# EAGLE schematic R42_ECU (EAGLE 9.6.2)
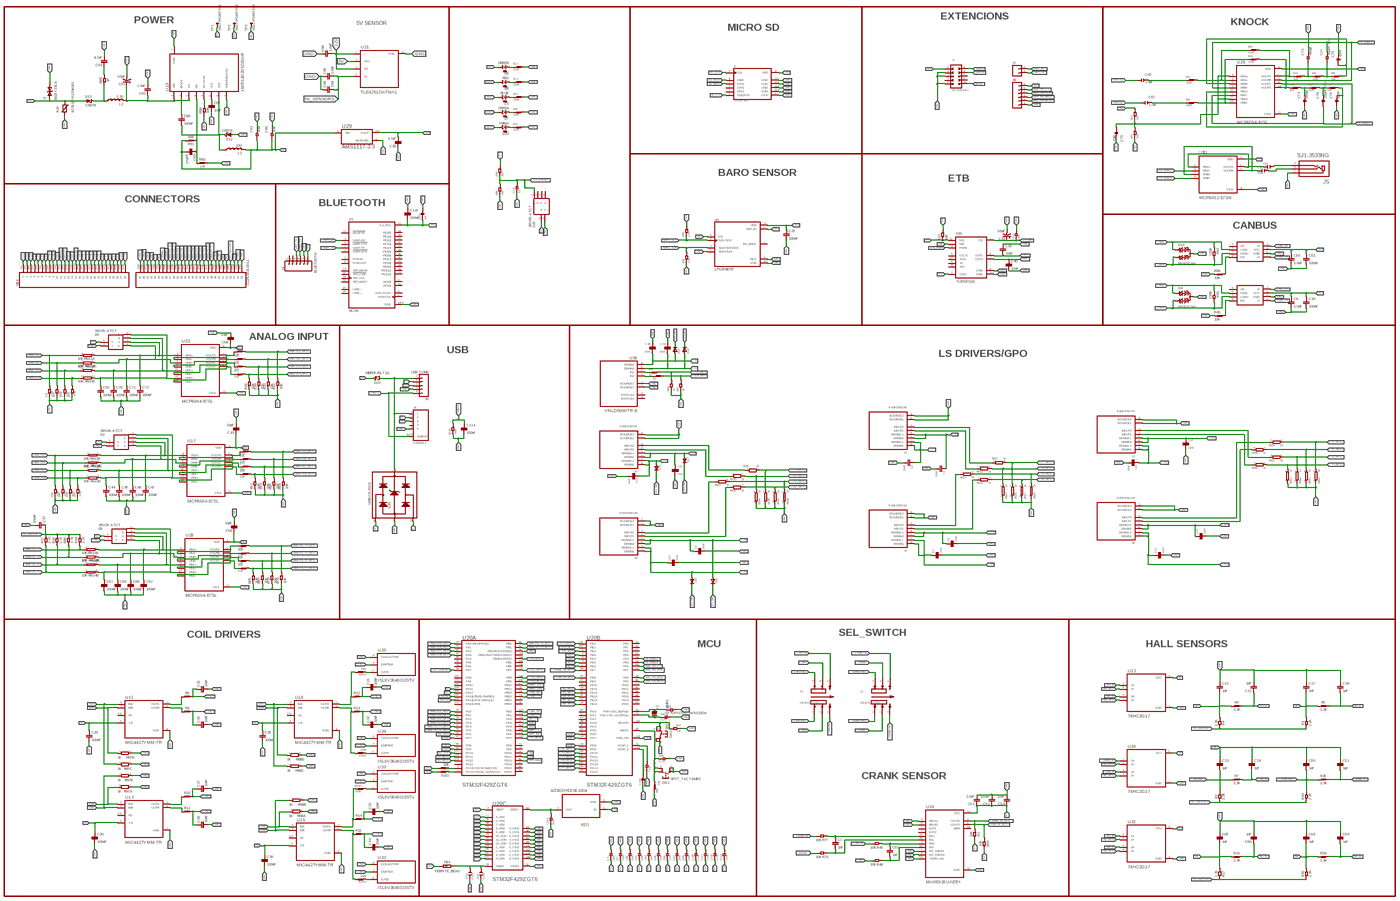
[diagram p0: schematic, sheet 1, overview]
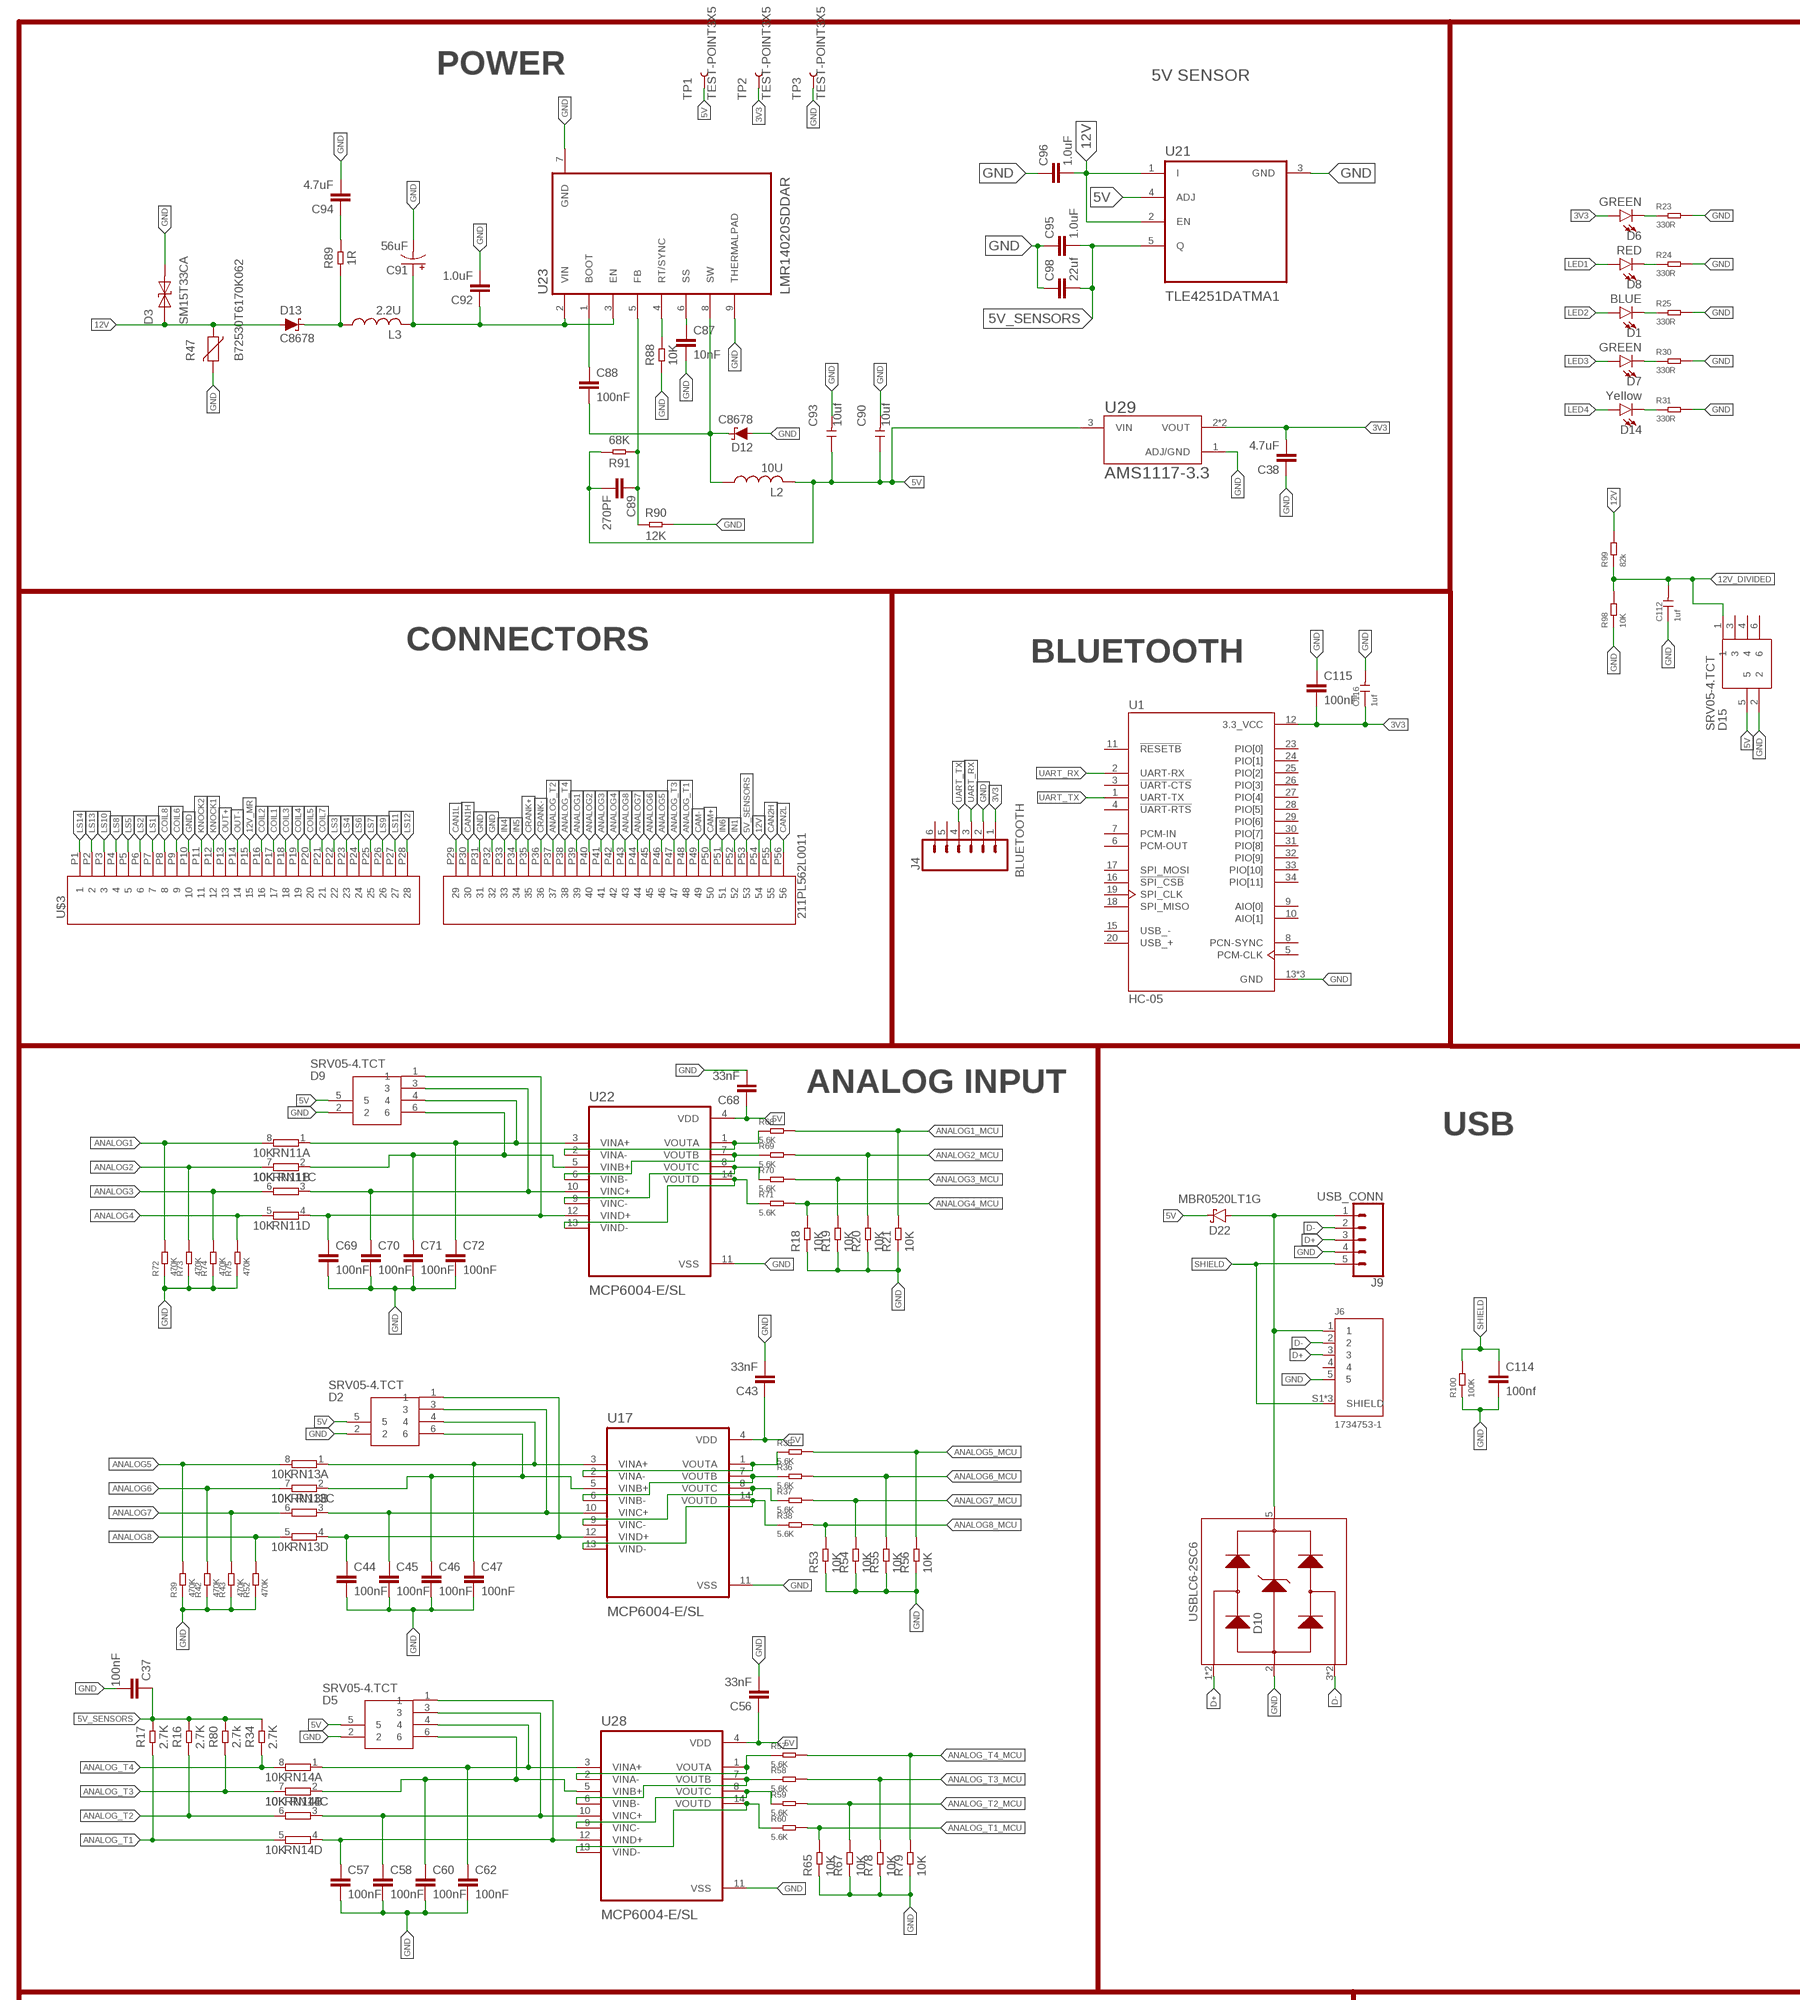
[diagram p1: schematic, sheet 1, part 1 of 6]
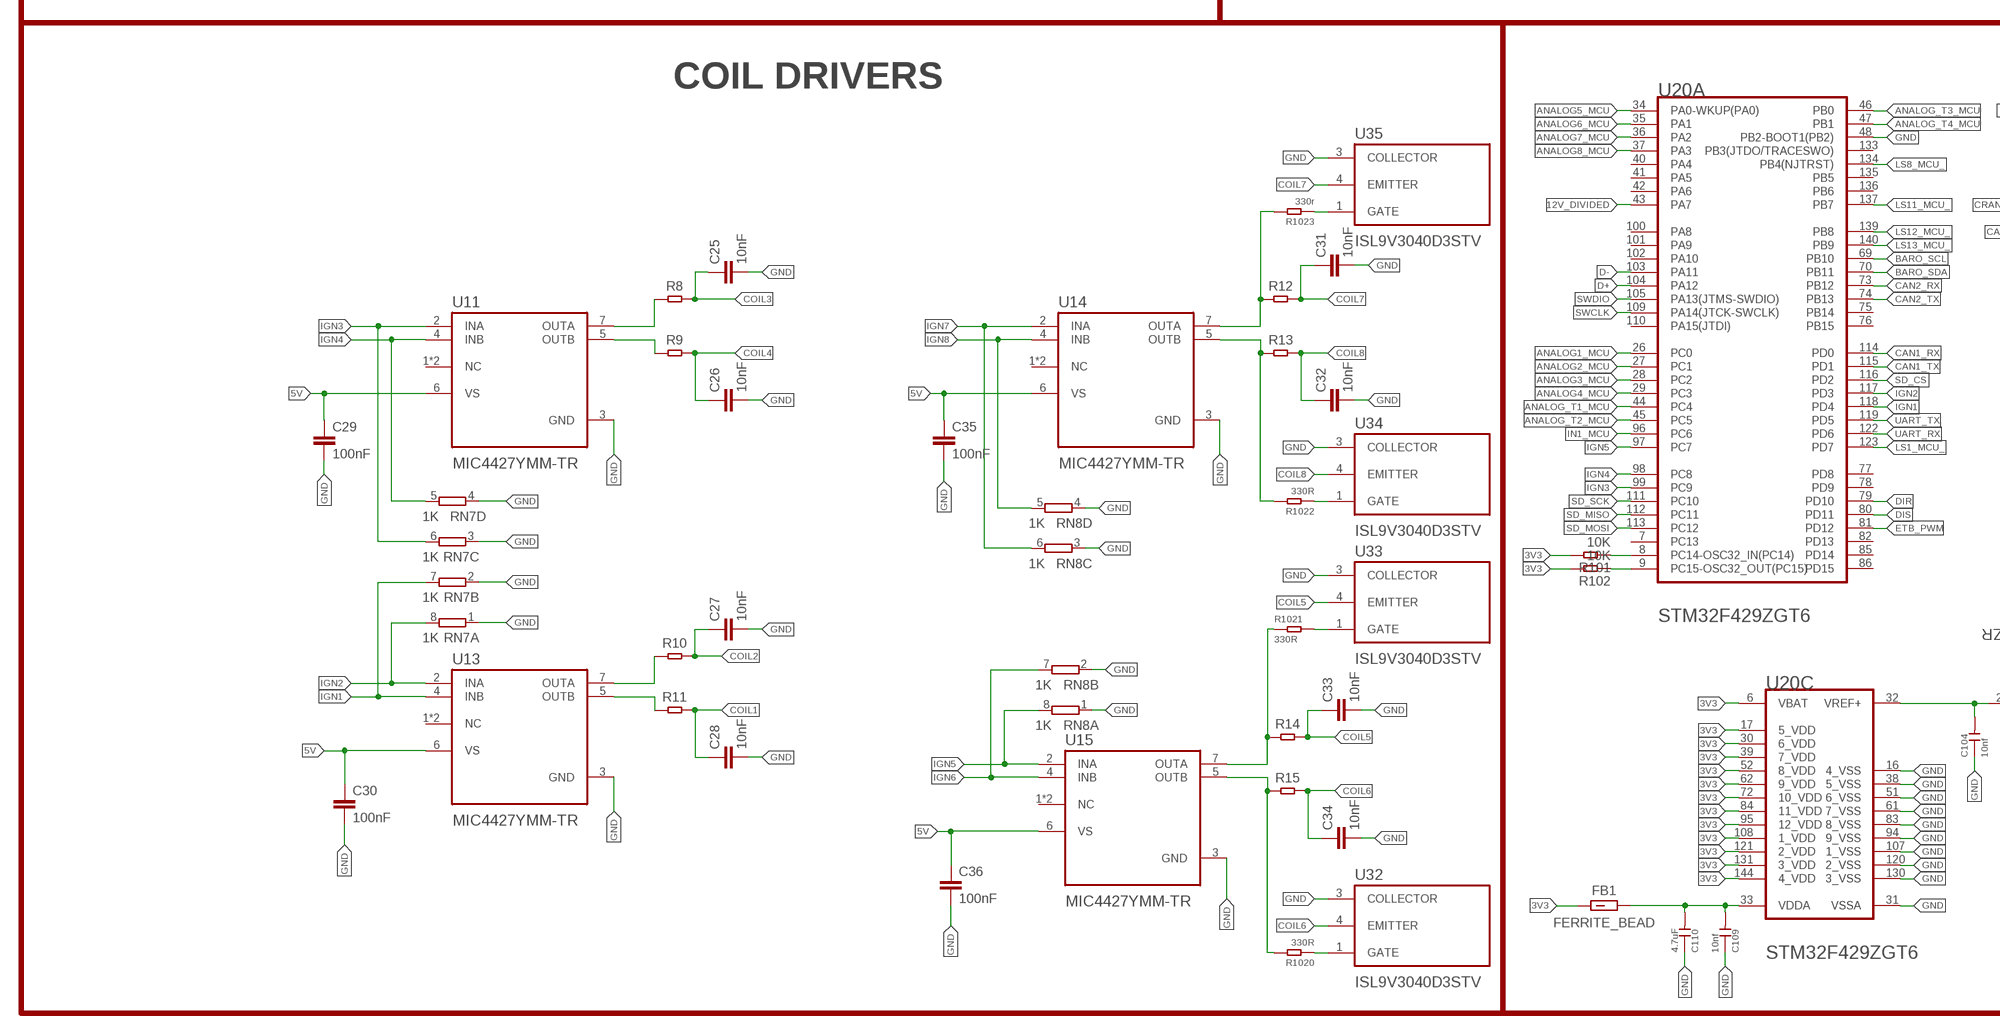
[diagram p2: schematic, sheet 1, part 2 of 6]
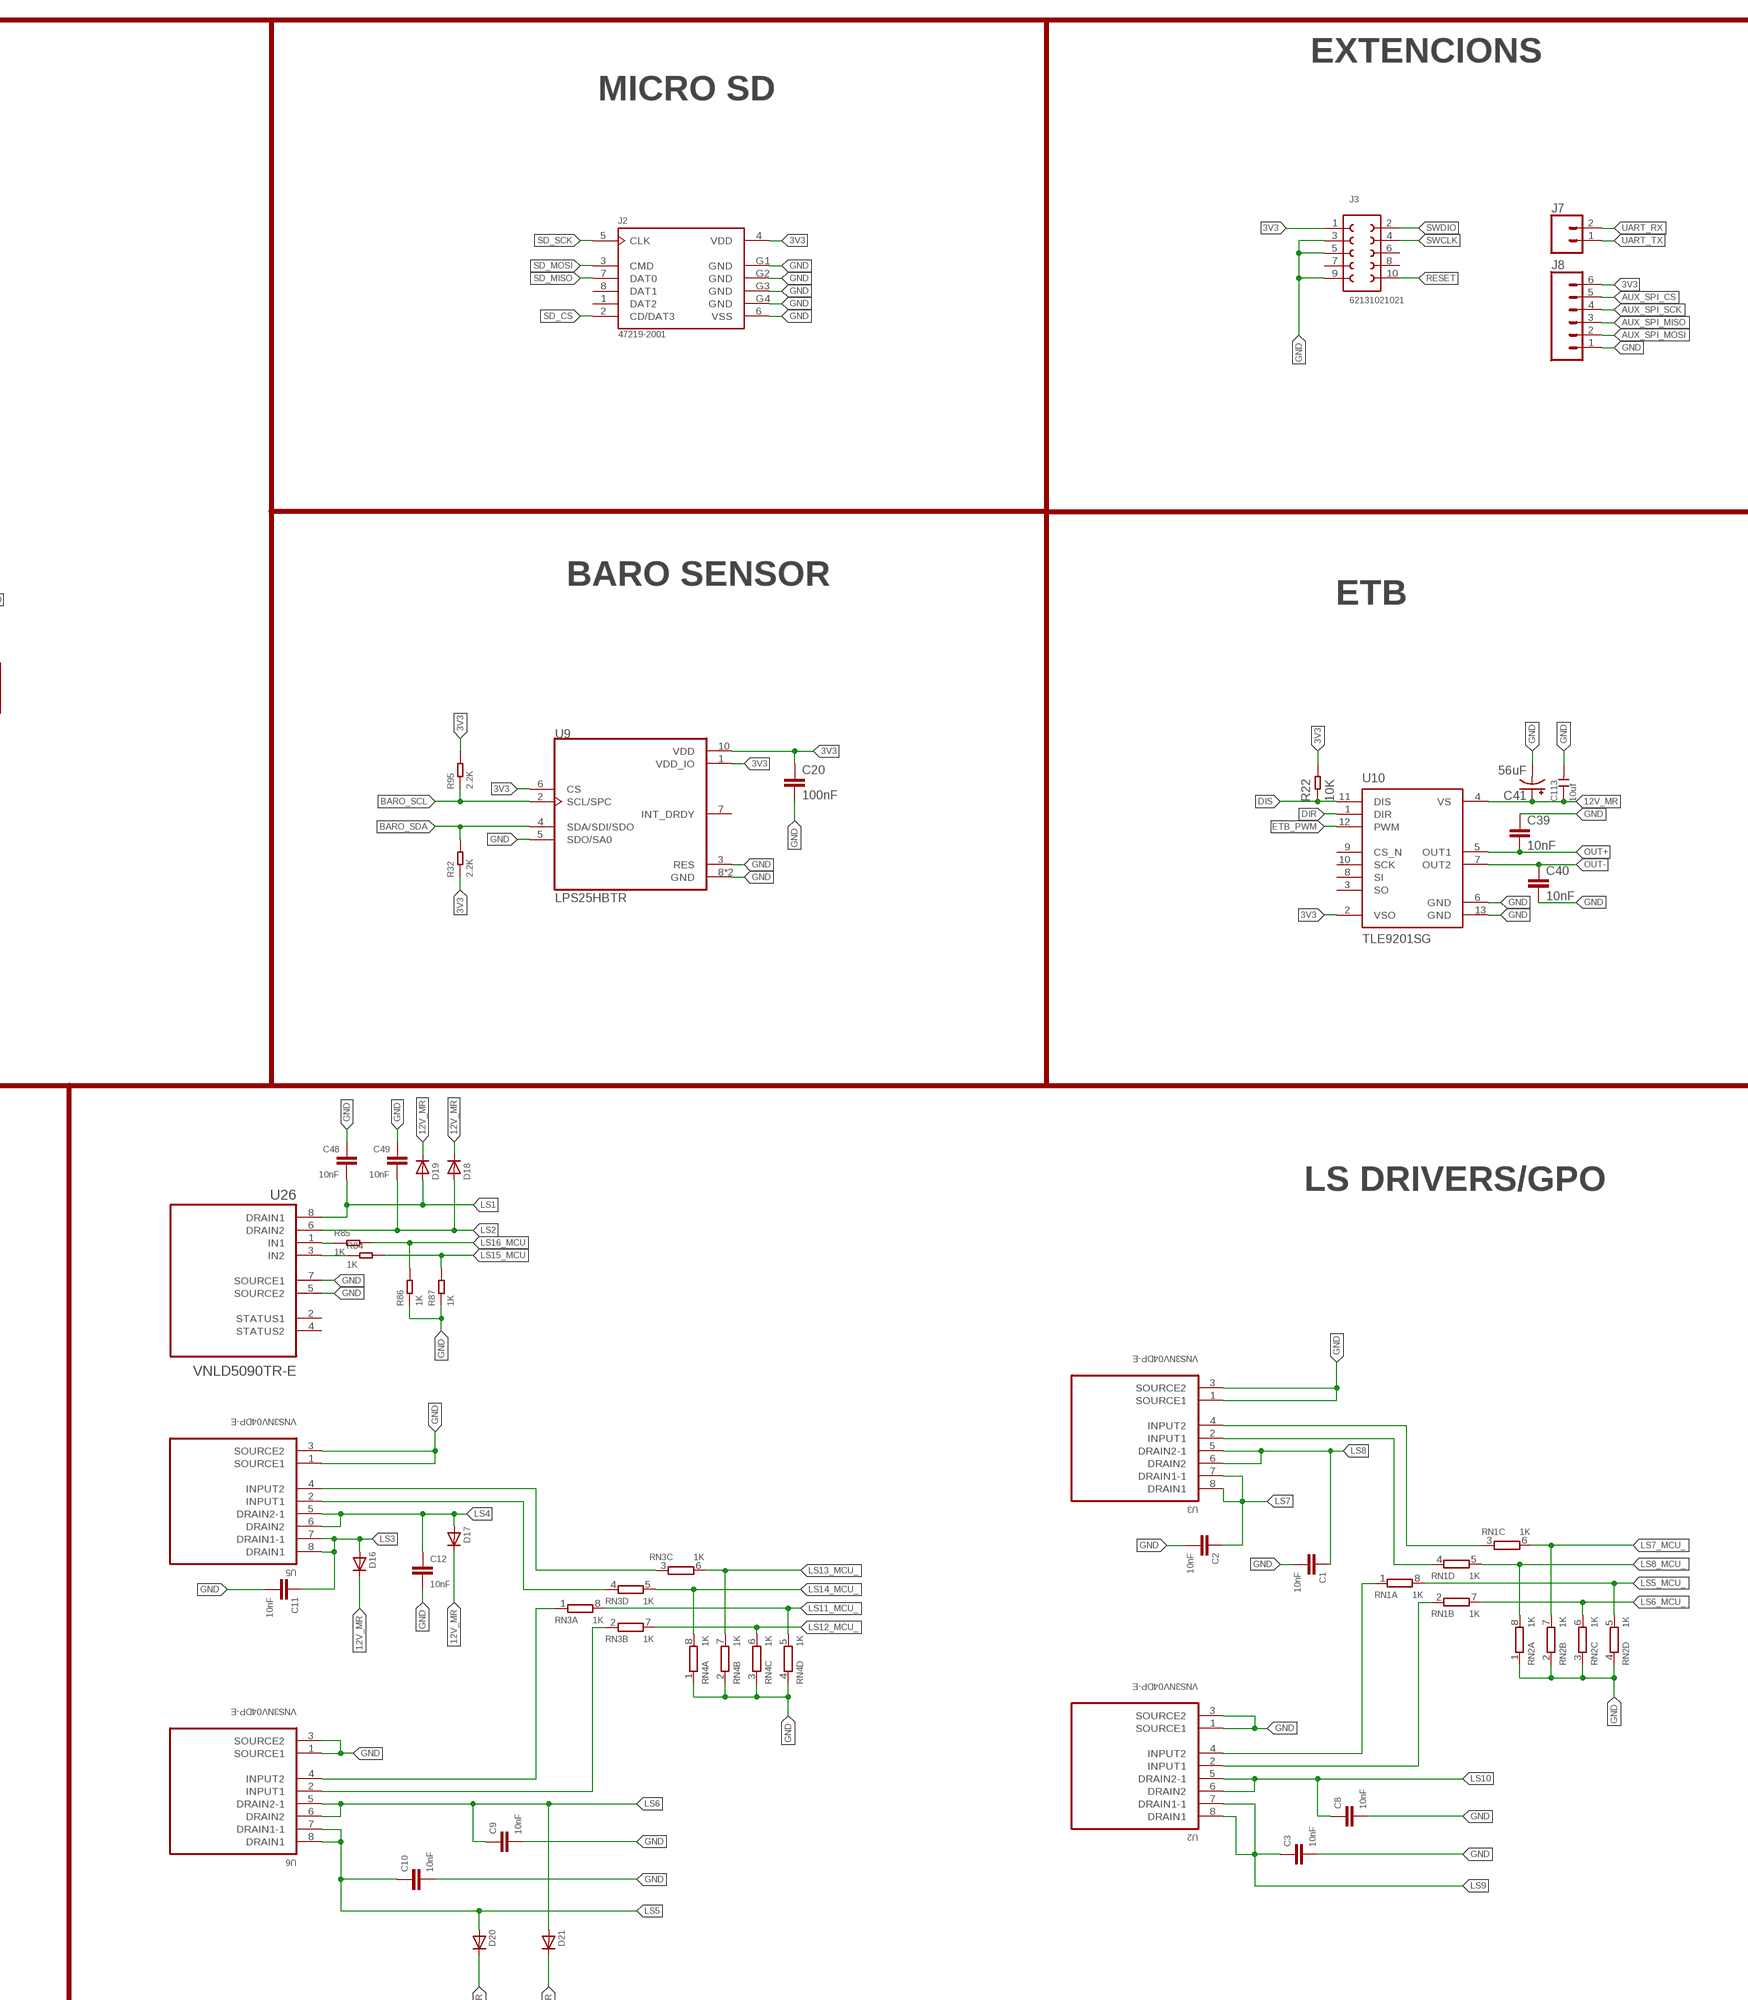
[diagram p3: schematic, sheet 1, part 3 of 6]
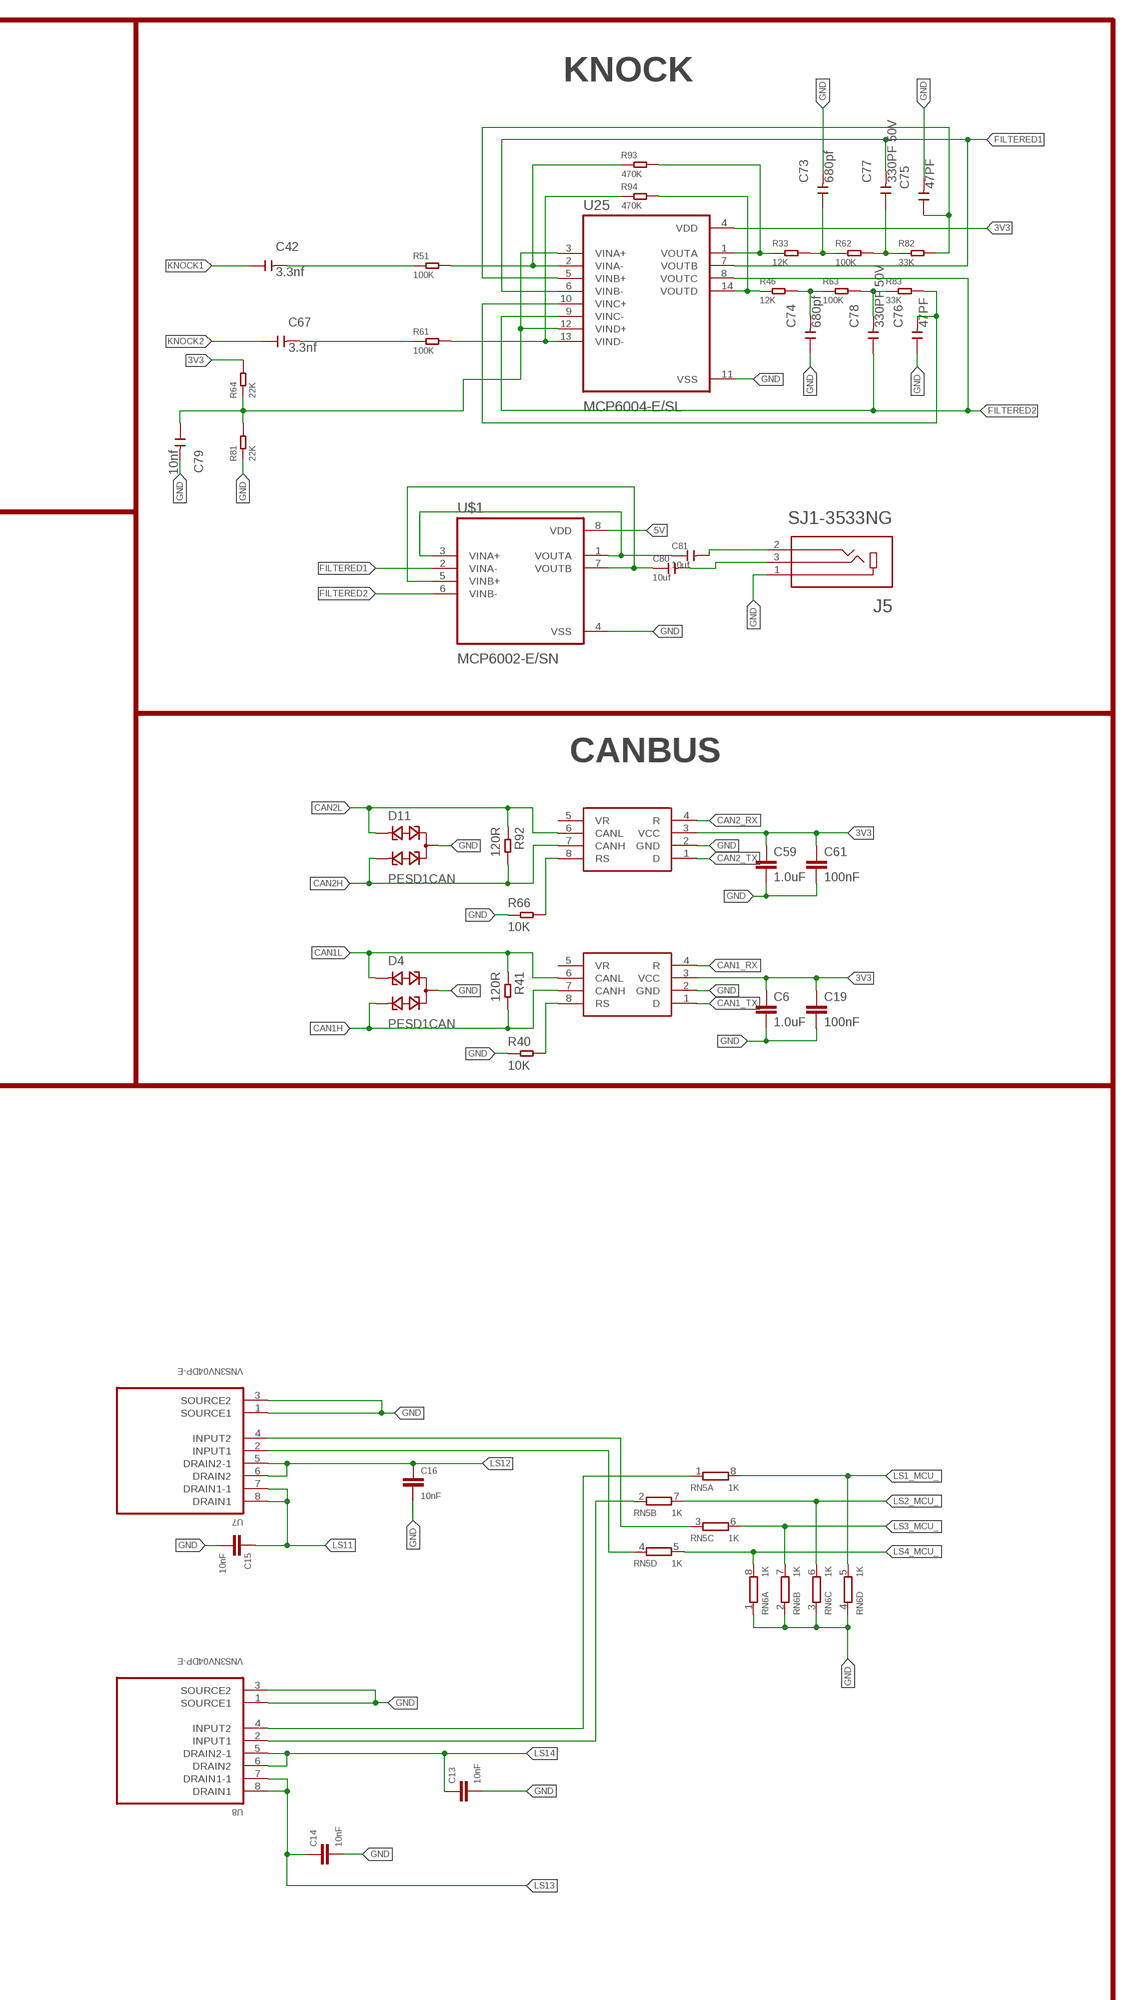
[diagram p4: schematic, sheet 1, part 4 of 6]
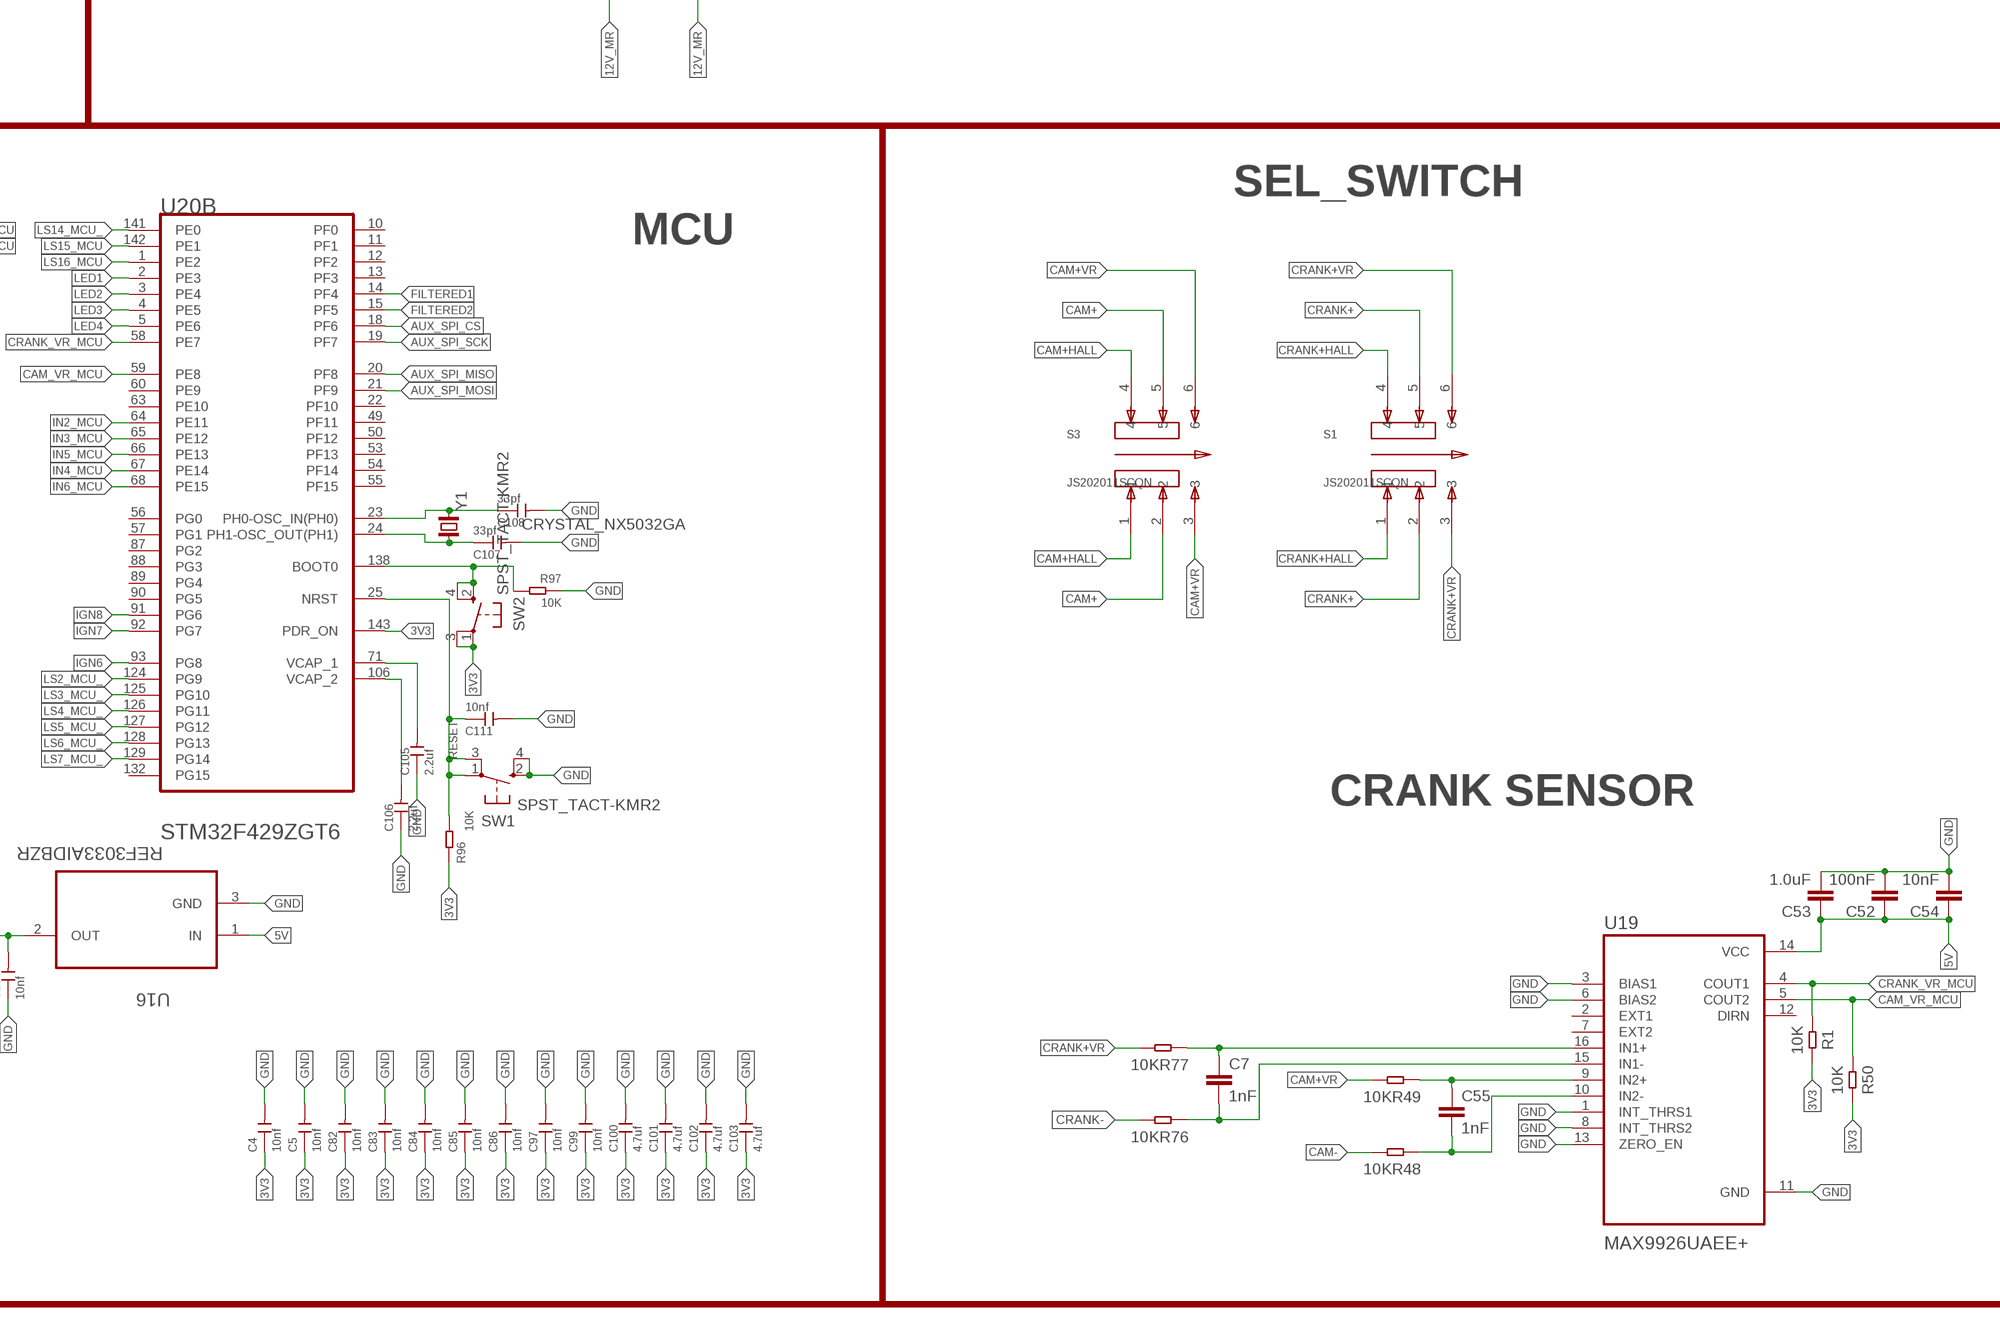
[diagram p5: schematic, sheet 1, part 5 of 6]
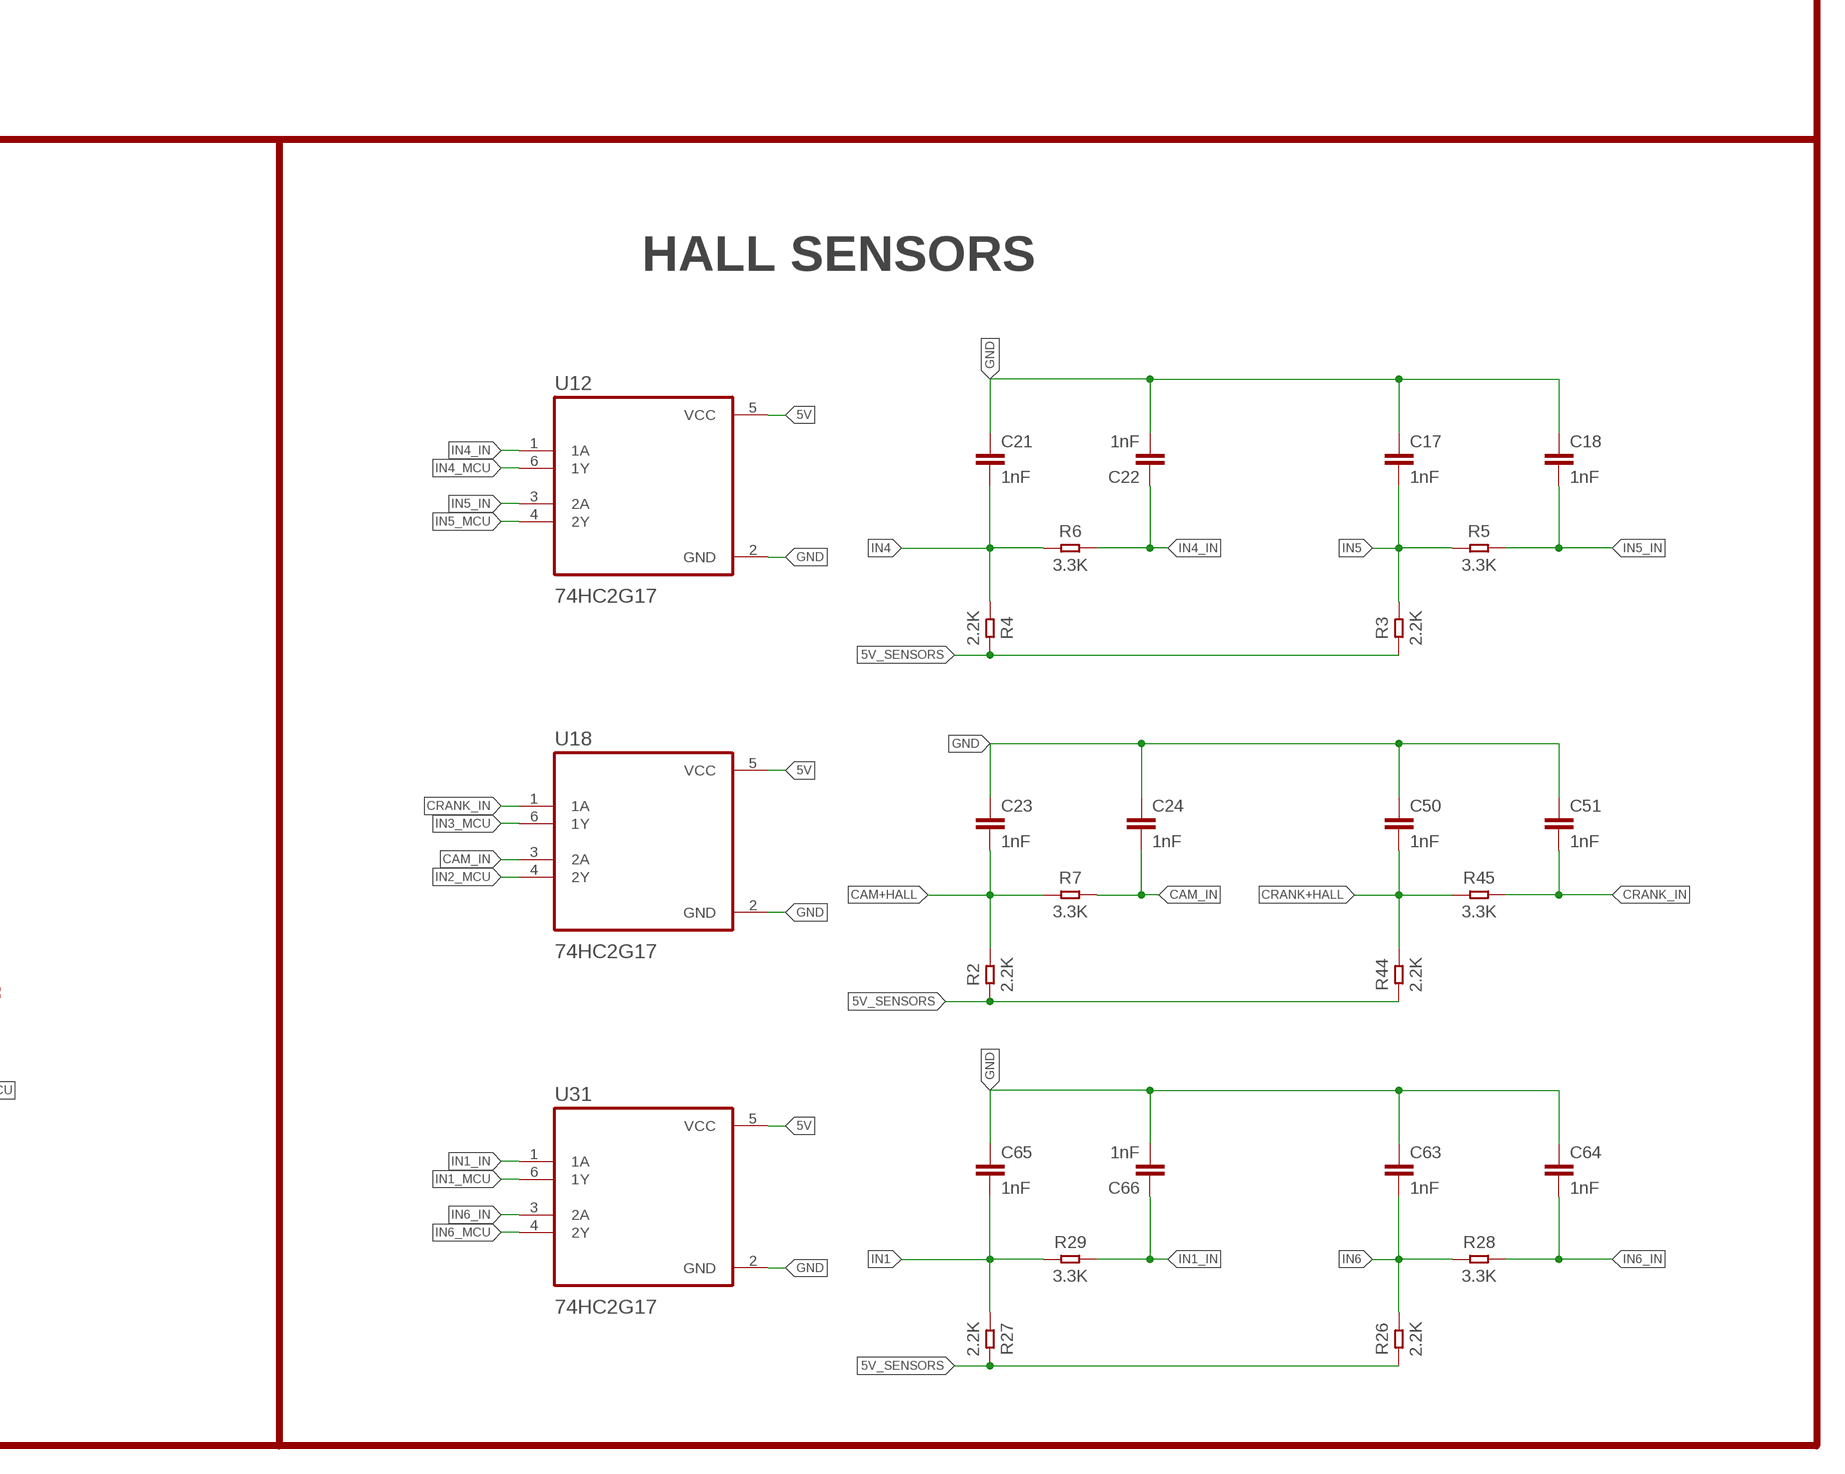
[diagram p6: schematic, sheet 1, part 6 of 6]

## Parts
C1  10nF  10NF-0603-50V-10%  [0603]
C2  10nF  10NF-0603-50V-10%  [0603]
C3  10nF  10NF-0603-50V-10%  [0603]
C4  10nf  CERAMIC-10NF-50V-10%-X7R(0603)  [C0603]
C5  10nf  CERAMIC-10NF-50V-10%-X7R(0603)  [C0603]
C6  1.0uF  1.0UF-0603-16V-10%  [0603]
C7  1nF  1.0NF/1000PF-0603-50V-10%  [0603]
C8  10nF  10NF-0603-50V-10%  [0603]
C9  10nF  10NF-0603-50V-10%  [0603]
C10  10nF  10NF-0603-50V-10%  [0603]
C11  10nF  10NF-0603-50V-10%  [0603]
C12  10nF  10NF-0603-50V-10%  [0603]
C13  10nF  10NF-0603-50V-10%  [0603]
C14  10nF  10NF-0603-50V-10%  [0603]
C15  10nF  10NF-0603-50V-10%  [0603]
C16  10nF  10NF-0603-50V-10%  [0603]
C17  1nF  1.0NF/1000PF-0603-50V-10%  [0603]
C18  1nF  1.0NF/1000PF-0603-50V-10%  [0603]
C19  100nF  0.1UF-0603-25V-(+80/-20%)  [0603]
C20  100nF  1.0UF-0603-16V-10%  [0603]
C21  1nF  1.0NF/1000PF-0603-50V-10%  [0603]
C22  1nF  1.0NF/1000PF-0603-50V-10%  [0603]
C23  1nF  1.0NF/1000PF-0603-50V-10%  [0603]
C24  1nF  1.0NF/1000PF-0603-50V-10%  [0603]
C25  10nF  10NF-0603-50V-10%  [0603]
C26  10nF  10NF-0603-50V-10%  [0603]
C27  10nF  10NF-0603-50V-10%  [0603]
C28  10nF  10NF-0603-50V-10%  [0603]
C29  100nF  0.1UF-0603-25V-(+80/-20%)  [0603]
C30  100nF  0.1UF-0603-25V-(+80/-20%)  [0603]
C31  10nF  10NF-0603-50V-10%  [0603]
C32  10nF  10NF-0603-50V-10%  [0603]
C33  10nF  10NF-0603-50V-10%  [0603]
C34  10nF  10NF-0603-50V-10%  [0603]
C35  100nF  0.1UF-0603-25V-(+80/-20%)  [0603]
C36  100nF  0.1UF-0603-25V-(+80/-20%)  [0603]
C37  100nF  0.1UF-0603-25V-(+80/-20%)  [0603]
C38  4.7uF  4.7UF0603  [0603]
C39  10nF  10NF-0603-50V-10%  [0603]
C40  10nF  10NF-0603-50V-10%  [0603]
C41  56uF  CPOL-USE3.5-8  [E3,5-8]
C42  3.3nf  CERAMIC-10NF-50V-5%-X7R(0805)  [C0805]
C43  33nF  33NF-0603-50V-10%  [0603]
C44  100nF  22PF-0603-50V-5%  [0603]
C45  100nF  22PF-0603-50V-5%  [0603]
C46  100nF  22PF-0603-50V-5%  [0603]
C47  100nF  22PF-0603-50V-5%  [0603]
C48  10nF  10NF-0603-50V-10%  [0603]
C49  10nF  10NF-0603-50V-10%  [0603]
C50  1nF  1.0NF/1000PF-0603-50V-10%  [0603]
C51  1nF  1.0NF/1000PF-0603-50V-10%  [0603]
C52  100nF  0.1UF-0603-25V-(+80/-20%)  [0603]
C53  1.0uF  1.0UF-0603-16V-10%  [0603]
C54  10nF  10NF-0603-50V-10%  [0603]
C55  1nF  1.0NF/1000PF-0603-50V-10%  [0603]
C56  33nF  33NF-0603-50V-10%  [0603]
C57  100nF  22PF-0603-50V-5%  [0603]
C58  100nF  22PF-0603-50V-5%  [0603]
C59  1.0uF  1.0UF-0603-16V-10%  [0603]
C60  100nF  22PF-0603-50V-5%  [0603]
C61  100nF  0.1UF-0603-25V-(+80/-20%)  [0603]
C62  100nF  22PF-0603-50V-5%  [0603]
C63  1nF  1.0NF/1000PF-0603-50V-10%  [0603]
C64  1nF  1.0NF/1000PF-0603-50V-10%  [0603]
C65  1nF  1.0NF/1000PF-0603-50V-10%  [0603]
C66  1nF  1.0NF/1000PF-0603-50V-10%  [0603]
C67  3.3nf  CERAMIC-10NF-50V-5%-X7R(0805)  [C0805]
C68  33nF  33NF-0603-50V-10%  [0603]
C69  100nF  22PF-0603-50V-5%  [0603]
C70  100nF  22PF-0603-50V-5%  [0603]
C71  100nF  22PF-0603-50V-5%  [0603]
C72  100nF  22PF-0603-50V-5%  [0603]
C73  680pf  CERAMIC-100NF-50V-10%-X7R(0603)  [C0603]
C74  680pf  CERAMIC-100NF-50V-10%-X7R(0603)  [C0603]
C75  47PF  CERAMIC-47PF-50V-5%-NP0(0402)  [C0402]
C76  47PF  CERAMIC-47PF-50V-5%-NP0(0402)  [C0402]
C77  330PF 50V  CERAMIC-390PF-50V-10%-X7R(0402)  [C0402]
C78  330PF 50V  CERAMIC-390PF-50V-10%-X7R(0402)  [C0402]
C79  10nf  CERAMIC-10NF-50V-10%-X7R(0402)  [C0402]
C80  10uf  CERAMIC-10UF-10V-(-20%～+80%)-Y5V(0805)  [C0805]
C81  10uf  CERAMIC-10UF-10V-(-20%～+80%)-Y5V(0805)  [C0805]
C82  10nf  CERAMIC-10NF-50V-10%-X7R(0603)  [C0603]
C83  10nf  CERAMIC-10NF-50V-10%-X7R(0603)  [C0603]
C84  10nf  CERAMIC-10NF-50V-10%-X7R(0603)  [C0603]
C85  10nf  CERAMIC-10NF-50V-10%-X7R(0603)  [C0603]
C86  10nf  CERAMIC-10NF-50V-10%-X7R(0603)  [C0603]
C87  10nF  10NF-0603-50V-10%  [0603]
C88  100nF  0.1UF-0603-25V-(+80/-20%)  [0603]
C89  270PF  270PF-0603-50V-5%  [0603]
C90  10uf  CERAMIC-10UF-25V-10%-X5R(1206)  [C1206]
C91  56uF  CPOL-USE3.5-8  [E3,5-8]
C92  1.0uF  1.0UF-0603-16V-10%  [0603]
C93  10uf  CERAMIC-10UF-25V-10%-X5R(1206)  [C1206]
C94  4.7uF  4.7UF0603  [0603]
C95  1.0uF  1.0UF-0603-16V-10%  [0603]
C96  1.0uF  1.0UF-0603-16V-10%  [0603]
C97  10nf  CERAMIC-10NF-50V-10%-X7R(0603)  [C0603]
C98  22uf  22PF-0603-50V-5%  [0603]
C99  10nf  CERAMIC-10NF-50V-10%-X7R(0603)  [C0603]
C100  4.7uf  CERAMIC-4.7UF-10V-10%-X5R(0603)  [C0603]
C101  4.7uf  CERAMIC-4.7UF-10V-10%-X5R(0603)  [C0603]
C102  4.7uf  CERAMIC-4.7UF-10V-10%-X5R(0603)  [C0603]
C103  4.7uf  CERAMIC-4.7UF-10V-10%-X5R(0603)  [C0603]
C104  10nf  CERAMIC-10NF-50V-10%-X7R(0603)  [C0603]
C105  2.2uf  CERAMIC-2.2UF-10V-10%-X7R(0603)  [C0603]
C106  2.2uf  CERAMIC-2.2UF-10V-10%-X7R(0603)  [C0603]
C107  33pf  CERAMIC-33PF-50V-5%-NPO(0402)  [C0402]
C108  33pf  CERAMIC-33PF-50V-5%-NPO(0402)  [C0402]
C109  10nf  CERAMIC-10NF-50V-10%-X7R(0603)  [C0603]
C110  4.7uF  CERAMIC-4.7NF-50V-10%-X7R(0603)  [C0603]
C111  10nf  CERAMIC-10NF-50V-10%-X7R(0603)  [C0603]
C112  1uf  CERAMIC-1UF-25V-10%-X7R(0603)  [C0603]
C113  10uf  CERAMIC-10UF-25V-10%-X5R(1206)  [C1206]
C114  100nf  0.1UF-0603-25V-(+80/-20%)  [0603]
C115  100nF  0.1UF-0603-25V-(+80/-20%)  [0603]
C116  1uf  CERAMIC-1UF-25V-10%-X7R(0603)  [C0603]
D1  BLUE  LED-BLUE0603  [LED-0603]
D2  SRV05-4.TCT  [SOT95P280X145-6N]
D3  SM15T33CA  SMCJ45CA  [DIOM7959X262N]
D4  PESD1CAN  [SOT23]
D5  SRV05-4.TCT  [SOT95P280X145-6N]
D6  GREEN  LED-GREEN0603  [LED-0603]
D7  GREEN  LED-GREEN0603  [LED-0603]
D8  RED  LED-RED0603  [LED-0603]
D9  SRV05-4.TCT  [SOT95P280X145-6N]
D10  USBLC6-2SC6  [SOT95P280X145-6N]
D11  PESD1CAN  [SOT23]
D12  C8678  DIODE-SCHOTTKY-B340A  [SMA-DIODE]
D13  C8678  DIODE-SCHOTTKY-B340A  [SMA-DIODE]
D14  Yellow  LED-YELLOW0603  [LED-0603]
D15  SRV05-4.TCT  [SOT95P280X145-6N]
D16  MBR0520LT1G  DIODE_SOD-123FL  [SOD-123FL]
D17  MBR0520LT1G  DIODE_SOD-123FL  [SOD-123FL]
D18  MBR0520LT1G  DIODE_SOD-123FL  [SOD-123FL]
D19  MBR0520LT1G  DIODE_SOD-123FL  [SOD-123FL]
D20  MBR0520LT1G  DIODE_SOD-123FL  [SOD-123FL]
D21  MBR0520LT1G  DIODE_SOD-123FL  [SOD-123FL]
D22  MBR0520LT1G  SCHOTTKY_MBR0520LT1GDO-219  [SODFL3718X115]
FB1  FERRITE_BEAD  FBCHIP-0805(2012-METRIC)  [BEADC2012X105N]
J2  47219-2001  [MOLEX_47219-2001]
J3  62131021021  [62131021021]
J4  CONN_06NO_SILK_NO_POP  [1X06_NO_SILK]
J5  SJ1-3533NG  [CUI_SJ1-3533NG]
J6  1734753-1  [CONN_1734753-1]
J7  CONN_02  [1X02]
J8  CONN_06SILK_FEMALE_PTH  [1X06]
J9  USB_CONN  CONN_05NO_SILK  [1X05_NO_SILK]
L2  10U  L-US  [0503]
L3  2.2U  L-USL3225M  [L3225M]
R1  10K  SMD-RES-10K-1%-1/8W(0805)  [R0805]
R2  2.2K  SMD-RES-2.2K-5%-1/10W(0603)  [R0603]
R3  2.2K  SMD-RES-2.2K-5%-1/10W(0603)  [R0603]
R4  2.2K  SMD-RES-2.2K-5%-1/10W(0603)  [R0603]
R5  3.3K  SMD-RES-3.3K-1%-1/10W(0603)  [R0603]
R6  3.3K  SMD-RES-3.3K-1%-1/10W(0603)  [R0603]
R7  3.3K  SMD-RES-3.3K-1%-1/10W(0603)  [R0603]
R8  100R  SMD-RES-100R-5%-1/8W(0805)  [R0805]
R9  100R  SMD-RES-100R-5%-1/8W(0805)  [R0805]
R10  100R  SMD-RES-100R-5%-1/8W(0805)  [R0805]
R11  100R  SMD-RES-100R-5%-1/8W(0805)  [R0805]
R12  100R  SMD-RES-100R-5%-1/8W(0805)  [R0805]
R13  100R  SMD-RES-100R-5%-1/8W(0805)  [R0805]
R14  100R  SMD-RES-100R-5%-1/8W(0805)  [R0805]
R15  100R  SMD-RES-100R-5%-1/8W(0805)  [R0805]
R16  2.7K  SMD-RES-2K-1%-1/10W(0603)  [R0603]
R17  2.7K  SMD-RES-2K-1%-1/10W(0603)  [R0603]
R18  10K  SMD-RES-10K-1%-1/10W(0603)  [R0603]
R19  10K  SMD-RES-10K-1%-1/10W(0603)  [R0603]
R20  10K  SMD-RES-10K-1%-1/10W(0603)  [R0603]
R21  10K  SMD-RES-10K-1%-1/10W(0603)  [R0603]
R22  10K  SMD-RES-10K-1%-1/10W(0603)  [R0603]
R23  330R  SMD-RES-330R-1%-1/16W(0402)  [R0402]
R24  330R  SMD-RES-330R-1%-1/16W(0402)  [R0402]
R25  330R  SMD-RES-330R-1%-1/16W(0402)  [R0402]
R26  2.2K  SMD-RES-2.2K-5%-1/10W(0603)  [R0603]
R27  2.2K  SMD-RES-2.2K-5%-1/10W(0603)  [R0603]
R28  3.3K  SMD-RES-3.3K-1%-1/10W(0603)  [R0603]
R29  3.3K  SMD-RES-3.3K-1%-1/10W(0603)  [R0603]
R30  330R  SMD-RES-330R-1%-1/16W(0402)  [R0402]
R31  330R  SMD-RES-330R-1%-1/16W(0402)  [R0402]
R32  2.2K  SMD-RES-2.2K-1%-1/10W(0603)  [R0603]
R33  12K  SMD-RES-12K-1%-1/16W(0402)  [R0402]
R34  2.7K  SMD-RES-2K-1%-1/10W(0603)  [R0603]
R35  5.6K  SMD-RES-330R-1%-1/10W(0603)  [R0603]
R36  5.6K  SMD-RES-330R-1%-1/10W(0603)  [R0603]
R37  5.6K  SMD-RES-330R-1%-1/10W(0603)  [R0603]
R38  5.6K  SMD-RES-330R-1%-1/10W(0603)  [R0603]
R39  470K  SMD-RES-470K-1%-1/10W(0603)  [R0603]
R40  10K  SMD-RES-10K-1%-1/10W(0603)  [R0603]
R41  120R  SMD-RES-100R-5%-1/10W(0603)  [R0603]
R42  470K  SMD-RES-470K-1%-1/10W(0603)  [R0603]
R43  470K  SMD-RES-470K-1%-1/10W(0603)  [R0603]
R44  2.2K  SMD-RES-2.2K-5%-1/10W(0603)  [R0603]
R45  3.3K  SMD-RES-3.3K-1%-1/10W(0603)  [R0603]
R46  12K  SMD-RES-12K-1%-1/16W(0402)  [R0402]
R47  B72530T6170K062  VARISTOR-5  [R-5]
R48  10K  SMD-RES-10K-1%-1/8W(0805)  [R0805]
R49  10K  SMD-RES-10K-1%-1/8W(0805)  [R0805]
R50  10K  SMD-RES-10K-1%-1/8W(0805)  [R0805]
R51  100K  SMD-RES-100K-1%-1/16W(0402)  [R0402]
R52  470K  SMD-RES-470K-1%-1/10W(0603)  [R0603]
R53  10K  SMD-RES-10K-1%-1/10W(0603)  [R0603]
R54  10K  SMD-RES-10K-1%-1/10W(0603)  [R0603]
R55  10K  SMD-RES-10K-1%-1/10W(0603)  [R0603]
R56  10K  SMD-RES-10K-1%-1/10W(0603)  [R0603]
R57  5.6K  SMD-RES-330R-1%-1/10W(0603)  [R0603]
R58  5.6K  SMD-RES-330R-1%-1/10W(0603)  [R0603]
R59  5.6K  SMD-RES-330R-1%-1/10W(0603)  [R0603]
R60  5.6K  SMD-RES-330R-1%-1/10W(0603)  [R0603]
R61  100K  SMD-RES-100K-1%-1/16W(0402)  [R0402]
R62  100K  SMD-RES-100K-1%-1/16W(0402)  [R0402]
R63  100K  SMD-RES-100K-1%-1/16W(0402)  [R0402]
R64  22K  SMD-RES-22R-1%-1/16W(0402)  [R0402]
R65  10K  SMD-RES-10K-1%-1/10W(0603)  [R0603]
R66  10K  SMD-RES-10K-1%-1/10W(0603)  [R0603]
R67  10K  SMD-RES-10K-1%-1/10W(0603)  [R0603]
R68  5.6K  SMD-RES-330R-1%-1/10W(0603)  [R0603]
R69  5.6K  SMD-RES-330R-1%-1/10W(0603)  [R0603]
R70  5.6K  SMD-RES-330R-1%-1/10W(0603)  [R0603]
R71  5.6K  SMD-RES-330R-1%-1/10W(0603)  [R0603]
R72  470K  SMD-RES-470K-1%-1/10W(0603)  [R0603]
R73  470K  SMD-RES-470K-1%-1/10W(0603)  [R0603]
R74  470K  SMD-RES-470K-1%-1/10W(0603)  [R0603]
R75  470K  SMD-RES-470K-1%-1/10W(0603)  [R0603]
R76  10K  SMD-RES-10K-1%-1/8W(0805)  [R0805]
R77  10K  SMD-RES-10K-1%-1/8W(0805)  [R0805]
R78  10K  SMD-RES-10K-1%-1/10W(0603)  [R0603]
R79  10K  SMD-RES-10K-1%-1/10W(0603)  [R0603]
R80  2.7k  SMD-RES-2K-1%-1/10W(0603)  [R0603]
R81  22K  SMD-RES-22R-1%-1/16W(0402)  [R0402]
R82  33K  SMD-RES-30K-1%-1/16W(0402)  [R0402]
R83  33K  SMD-RES-30K-1%-1/16W(0402)  [R0402]
R84  1K  SMD-RES-1K-1%-1/16W(0402)  [R0402]
R85  1K  SMD-RES-1K-1%-1/16W(0402)  [R0402]
R86  1K  SMD-RES-1K-1%-1/16W(0402)  [R0402]
R87  1K  SMD-RES-1K-1%-1/16W(0402)  [R0402]
R88  10K  SMD-RES-10K-1%-1/10W(0603)  [R0603]
R89  1R  SMD-RES-0R-5%-1/10W(0603)  [R0603]
R90  12K  SMD-RES-12K-1%-1/16W(0402)  [R0402]
R91  68K  SMD-RES-68K-1%-1/10W(0603)  [R0603]
R92  120R  SMD-RES-100R-5%-1/10W(0603)  [R0603]
R93  470K  SMD-RES-470K-1%-1/16W(0402)  [R0402]
R94  470K  SMD-RES-470K-1%-1/16W(0402)  [R0402]
R95  2.2K  SMD-RES-2.2K-1%-1/10W(0603)  [R0603]
R96  10K  SMD-RES-10K-1%-1/10W(0603)  [R0603]
R97  10K  SMD-RES-10K-1%-1/10W(0603)  [R0603]
R98  10K  SMD-RES-10K-1%-1/10W(0603)  [R0603]
R99  82k  SMD-RES-120K-1%-1/10W(0603)  [R0603]
R100  100K  SMD-RES-100K-1%-1/16W(0402)  [R0402]
R101  10K  SMD-RES-10K-1%-1/10W(0603)  [R0603]
R102  10K  SMD-RES-10K-1%-1/10W(0603)  [R0603]
R1020  330R  SMD-RES-330R-1%-1/8W(0805)  [R0805]
R1021  330R  SMD-RES-330R-1%-1/8W(0805)  [R0805]
R1022  330R  SMD-RES-330R-1%-1/8W(0805)  [R0805]
R1023  330r  SMD-RES-330R-1%-1/8W(0805)  [R0805]
RN1  1K  4R-N0603-ARC  [0603-ARC]
RN2  1K  4R-N0603-ARC  [0603-ARC]
RN3  1K  4R-N0603-ARC  [0603-ARC]
RN4  1K  4R-N0603-ARC  [0603-ARC]
RN5  1K  4R-N0603-ARC  [0603-ARC]
RN6  1K  4R-N0603-ARC  [0603-ARC]
RN7  1K  4R-N0603-ARC  [0603-ARC]
RN8  1K  4R-N0603-ARC  [0603-ARC]
RN11  10K  4R-N0603-ARC  [0603-ARC]
RN13  10K  4R-N0603-ARC  [0603-ARC]
RN14  10K  4R-N0603-ARC  [0603-ARC]
S1  JS202011SCQN  [SW_JS202011SCQN]
S3  JS202011SCQN  [SW_JS202011SCQN]
SW1  SPST_TACT-KMR2  [KMR2]
SW2  SPST_TACT-KMR2  [KMR2]
TP1  TEST-POINT3X5  [PAD.03X.05]
TP2  TEST-POINT3X5  [PAD.03X.05]
TP3  TEST-POINT3X5  [PAD.03X.05]
U1  HC-05  [XCVR_HC-05]
U2  VNS3NV04DP-E  [SOIC127P600X175-8N]
U3  VNS3NV04DP-E  [SOIC127P600X175-8N]
U5  VNS3NV04DP-E  [SOIC127P600X175-8N]
U6  VNS3NV04DP-E  [SOIC127P600X175-8N]
U7  VNS3NV04DP-E  [SOIC127P600X175-8N]
U8  VNS3NV04DP-E  [SOIC127P600X175-8N]
U9  LPS25HBTR  [PQFN60P250X250X80-10N]
U10  TLE9201SG  [SOP100P1030X260-13N]
U11  MIC4427YMM-TR  [SOP65P490X110-8N]
U12  74HC2G17  74HC2G17GW,125  [SOP65P210X110-6N]
U13  MIC4427YMM-TR  [SOP65P490X110-8N]
U14  MIC4427YMM-TR  [SOP65P490X110-8N]
U15  MIC4427YMM-TR  [SOP65P490X110-8N]
U16  REF3033AIDBZR  [SOT95P237X112-3N]
U17  MCP6004-E/SL  [SOIC127P600X175-14N]
U18  74HC2G17  74HC2G17GW,125  [SOP65P210X110-6N]
U19  MAX9926UAEE+  [SOP63P602X175-16N]
U20  STMICROELECTRONICS_STM32F429ZGT6STMICROELECTRONICS_STM32F429ZGT6_0_2  [STMICROELECTRONICS_STM32F429ZGT6_2]
U21  TLE4251DATMA1  [TO114P998X235-5]
U22  MCP6004-E/SL  [SOIC127P600X175-14N]
U23  LMR14020SDDAR  [VREG_LM5017MR/NOPB]
U24  VD230  SN65HVD230  [SO08]
U25  MCP6004-E/SL  [SOIC127P600X175-14N]
U26  VNLD5090TR-E  [SOIC127P600X175-8N]
U27  VD230  SN65HVD230  [SO08]
U28  MCP6004-E/SL  [SOIC127P600X175-14N]
U29  AMS1117-3.3  [SOT229P700X180-4N]
U31  74HC2G17  74HC2G17GW,125  [SOP65P210X110-6N]
U32  ISL9V3040D3STV  [TO229P990X238-4N]
U33  ISL9V3040D3STV  [TO229P990X238-4N]
U34  ISL9V3040D3STV  [TO229P990X238-4N]
U35  ISL9V3040D3STV  [TO229P990X238-4N]
U$1  MCP6002-E/SN  [SOIC127P599X175-8N]
U$3  211PL562L0011  [211PL562L0011]
Y1  CRYSTAL_NX5032GA  [CRYSTAL_2-SMD-5X3]

## Nets
3V3: C4.1 C5.1 C6.1 C19.1 C20.1 C38.2 C59.1 C61.1 C82.1 C83.1 C84.1 C85.1 C86.1 C97.1 C99.1 C100.1 C101.1 C102.1 C103.1 C115.2 C116.1 D6.A FB1.2 J2.4(VDD) J3.1 J4.1 J8.6 R1.2 R22.2 R32.1 R50.2 R64.2 R95.2 R96.1 R101.2 R102.2 SW2.1(P) SW2.3(P1) TP2.P$1 U1.12(3.3_VCC) U9.1(VDD_IO) U9.6(CS) U9.10(VDD) U10.2(VSO) U20.6(C:VBAT) U20.17(C:5_VDD) U20.30(C:6_VDD) U20.39(C:7_VDD) U20.52(C:8_VDD) U20.62(C:9_VDD) U20.72(C:10_VDD) U20.84(C:11_VDD) U20.95(C:12_VDD) U20.108(C:1_VDD) U20.121(C:2_VDD) U20.131(C:3_VDD) U20.143(B:PDR_ON) U20.144(C:4_VDD) U24.3(VCC) U25.4(VDD) U27.3(VCC) U29.2(VOUT) U29.4(VOUT)
5V: C29.1 C30.1 C35.1 C36.1 C43.1 C52.2 C53.1 C54.2 C56.1 C68.1 C89.2 C90.1 C93.1 D2.5 D5.5 D9.5 D15.5 D22.1(C) L2.P$2 R91.2 TP1.P$1 U11.6(VS) U12.5(VCC) U13.6(VS) U14.6(VS) U15.6(VS) U16.1(IN) U17.4(VDD) U18.5(VCC) U19.14(VCC) U21.4(ADJ) U22.4(VDD) U28.4(VDD) U29.3(VIN) U31.5(VCC) U$1.8(VDD)
5V_SENSORS: C37.1 C95.2 C98.2 R2.1 R3.1 R4.2 R16.2 R17.2 R26.1 R27.2 R34.2 R44.1 R80.2 U21.5(Q) U$3.P53
12V: C96.2 D3.1 D13.A R47.1 R99.2 U21.1(I) U21.2(EN) U$3.P54
12V_DIVIDED: C112.2 D15.1 R98.2 R99.1 U20.43(A:PA7)
12V_MR: C41.+ C113.1 D16.C D17.C D18.C D19.C D20.C D21.C U10.4(VS) U$3.P15
ANALOG1: R72.2 RN11.8 U$3.P39
ANALOG1_MCU: R21.2 R68.2 U20.26(A:PC0)
ANALOG2: R73.2 RN11.7 U$3.P40
ANALOG2_MCU: R20.2 R69.2 U20.27(A:PC1)
ANALOG3: R74.2 RN11.6 U$3.P41
ANALOG3_MCU: R19.2 R70.2 U20.28(A:PC2)
ANALOG4: R75.2 RN11.5 U$3.P42
ANALOG4_MCU: R18.2 R71.2 U20.29(A:PC3)
ANALOG5: R39.2 RN13.8 U$3.P46
ANALOG5_MCU: R35.2 R56.2 U20.34(A:PA0-WKUP(PA0))
ANALOG6: R42.2 RN13.7 U$3.P45
ANALOG6_MCU: R36.2 R55.2 U20.35(A:PA1)
ANALOG7: R43.2 RN13.6 U$3.P44
ANALOG7_MCU: R37.2 R54.2 U20.36(A:PA2)
ANALOG8: R52.2 RN13.5 U$3.P43
ANALOG8_MCU: R38.2 R53.2 U20.37(A:PA3)
ANALOG_T1: R17.1 RN14.5 U$3.P48
ANALOG_T1_MCU: R60.2 R65.2 U20.44(A:PC4)
ANALOG_T2: R16.1 RN14.6 U$3.P37
ANALOG_T2_MCU: R59.2 R67.2 U20.45(A:PC5)
ANALOG_T3: R80.1 RN14.7 U$3.P47
ANALOG_T3_MCU: R58.2 R78.2 U20.46(A:PB0)
ANALOG_T4: R34.1 RN14.8 U$3.P38
ANALOG_T4_MCU: R57.2 R79.2 U20.47(A:PB1)
AUX_SPI_CS: J8.5 U20.18(B:PF6)
AUX_SPI_MISO: J8.3 U20.20(B:PF8)
AUX_SPI_MOSI: J8.2 U20.21(B:PF9)
AUX_SPI_SCK: J8.4 U20.19(B:PF7)
BARO_SCL: R95.1 U9.2(SCL/SPC) U20.69(A:PB10)
BARO_SDA: R32.2 U9.4(SDA/SDI/SDO) U20.70(A:PB11)
CAM+: S3.2 S3.5 U$3.P50
CAM+HALL: C23.2 R2.2 R7.1 S3.1 S3.4
CAM+VR: R49.2 S3.3 S3.6
CAM-: R48.2 U$3.P49
CAM_IN: C24.2 R7.2 U18.3(2A)
CAM_VR_MCU: R50.1 U19.5(COUT2) U20.59(B:PE8)
CAN1_RX: U20.114(A:PD0) U27.4(R)
CAN1_TX: U20.115(A:PD1) U27.1(D)
CAN1H: D4.2 R41.2 U27.7(CANH) U$3.P30
CAN1L: D4.1 R41.1 U27.6(CANL) U$3.P29
CAN2_RX: U20.73(A:PB12) U24.4(R)
CAN2_TX: U20.74(A:PB13) U24.1(D)
CAN2H: D11.2 R92.2 U24.7(CANH) U$3.P55
CAN2L: D11.1 R92.1 U24.6(CANL) U$3.P56
COIL1: C28.1 R11.2 U$3.P17
COIL2: C27.1 R10.2 U$3.P16
COIL3: C25.1 R8.2 U$3.P18
COIL4: C26.1 R9.2 U$3.P19
COIL5: C33.1 R14.2 U33.4(EMITTER) U$3.P20
COIL6: C34.1 R15.2 U32.4(EMITTER) U$3.P9
COIL7: C31.1 R12.2 U35.4(EMITTER) U$3.P21
COIL8: C32.1 R13.2 U34.4(EMITTER) U$3.P8
CRANK+: S1.2 S1.5 U$3.P35
CRANK+HALL: C50.2 R44.2 R45.1 S1.1 S1.4
CRANK+VR: R77.2 S1.3 S1.6
CRANK-: R76.2 U$3.P36
CRANK_IN: C51.2 R45.2 U18.1(1A)
CRANK_VR_MCU: R1.1 U19.4(COUT1) U20.58(B:PE7)
D+: D10.1(I/O1) D10.6(I/O1) J6.3 J9.3 U20.104(A:PA12)
D-: D10.3(I/O2) D10.4(I/O2) J6.2 J9.2 U20.103(A:PA11)
DIR: U10.1(DIR) U20.79(A:PD10)
DIS: R22.1 U10.11(DIS) U20.80(A:PD11)
ETB_PWM: U10.12(PWM) U20.81(A:PD12)
FILTERED1: C77.2 U20.14(B:PF4) U25.6(VINB-) U25.7(VOUTB) U$1.2(VINA-)
FILTERED2: C78.1 U20.15(B:PF5) U25.8(VOUTC) U25.9(VINC-) U$1.6(VINB-)
GND: C1.2 C2.2 C3.2 C4.2 C5.2 C6.2 C8.2 C9.2 C10.2 C11.2 C12.2 C13.2 C14.2 C15.2 C16.2 C17.1 C18.1 C19.2 C20.2 C21.1 C22.2 C23.1 C24.1 C25.2 C26.2 C27.2 C28.2 C29.2 C30.2 C31.2 C32.2 C33.2 C34.2 C35.2 C36.2 C37.2 C38.1 C39.1 C40.2 C41.- C43.2 C44.2 C45.2 C46.2 C47.2 C48.1 C49.1 C50.1 C51.1 C52.1 C53.2 C54.1 C56.2 C57.2 C58.2 C59.2 C60.2 C61.2 C62.2 C63.1 C64.1 C65.1 C66.2 C68.2 C69.2 C70.2 C71.2 C72.2 C73.2 C74.1 C75.2 C76.1 C79.2 C82.2 C83.2 C84.2 C85.2 C86.2 C87.2 C90.2 C91.- C92.2 C93.2 C94.2 C95.1 C96.1 C97.2 C98.1 C99.2 C100.2 C101.2 C102.2 C103.2 C104.1 C105.1 C106.1 C107.2 C108.2 C109.1 C110.1 C111.2 C112.1 C113.2 C114.2 C115.1 C116.2 D2.2 D3.2 D4.3 D5.2 D9.2 D10.2(GND) D11.3 D12.A D15.2 J2.6(VSS) J2.G1(GND) J2.G2(GND) J2.G3(GND) J2.G4(GND) J3.3 J3.5 J3.9 J4.2 J5.1 J6.5 J8.1 J9.4 R18.1 R19.1 R20.1 R21.1 R23.2 R24.2 R25.2 R30.2 R31.2 R39.1 R40.1 R42.1 R43.1 R47.2 R52.1 R53.1 R54.1 R55.1 R56.1 R65.1 R66.1 R67.1 R72.1 R73.1 R74.1 R75.1 R78.1 R79.1 R81.1 R86.1 R87.1 R88.1 R90.2 R97.1 R98.1 R100.1 RN2.1 RN2.2 RN2.3 RN2.4 RN4.1 RN4.2 RN4.3 RN4.4 RN6.1 RN6.2 RN6.3 RN6.4 RN7.1 RN7.2 RN7.3 RN7.4 RN8.1 RN8.2 RN8.3 RN8.4 SW1.2(S) SW1.4(S1) TP3.P$1 U1.13(GND) U1.21(GND) U1.22(GND) U2.1(SOURCE1) U2.3(SOURCE2) U3.1(SOURCE1) U3.3(SOURCE2) U5.1(SOURCE1) U5.3(SOURCE2) U6.1(SOURCE1) U6.3(SOURCE2) U7.1(SOURCE1) U7.3(SOURCE2) U8.1(SOURCE1) U8.3(SOURCE2) U9.3(RES) U9.5(SDO/SA0) U9.8(GND) U9.9(GND) U10.6(GND) U10.13(GND) U11.3(GND) U12.2(GND) U13.3(GND) U14.3(GND) U15.3(GND) U16.3(GND) U17.11(VSS) U18.2(GND) U19.1(INT_THRS1) U19.3(BIAS1) U19.6(BIAS2) U19.8(INT_THRS2) U19.11(GND) U19.13(ZERO_EN) U20.16(C:4_VSS) U20.31(C:VSSA) U20.38(C:5_VSS) U20.48(A:PB2-BOOT1(PB2)) U20.51(C:6_VSS) U20.61(C:7_VSS) U20.83(C:8_VSS) U20.94(C:9_VSS) U20.107(C:1_VSS) U20.120(C:2_VSS) U20.130(C:3_VSS) U21.3(GND) U22.11(VSS) U23.7(GND) U23.9(THERMALPAD) U24.2(GND) U25.11(VSS) U26.5(SOURCE2) U26.7(SOURCE1) U27.2(GND) U28.11(VSS) U29.1(ADJ/GND) U31.2(GND) U32.3(COLLECTOR) U33.3(COLLECTOR) U34.3(COLLECTOR) U35.3(COLLECTOR) U$1.4(VSS) U$3.P10 U$3.P31 U$3.P32
IGN1: RN7.7 U13.4(INB) U20.118(A:PD4)
IGN2: RN7.8 U13.2(INA) U20.117(A:PD3)
IGN3: RN7.6 U11.2(INA) U20.99(A:PC9)
IGN4: RN7.5 U11.4(INB) U20.98(A:PC8)
IGN5: RN8.8 U15.2(INA) U20.97(A:PC7)
IGN6: RN8.7 U15.4(INB) U20.93(B:PG8)
IGN7: RN8.6 U14.2(INA) U20.92(B:PG7)
IGN8: RN8.5 U14.4(INB) U20.91(B:PG6)
IN1: C65.2 R27.1 R29.1 U$3.P52
IN1_IN: C66.1 R29.2 U31.1(1A)
IN1_MCU: U20.96(A:PC6) U31.6(1Y)
IN2_MCU: U18.4(2Y) U20.64(B:PE11)
IN3_MCU: U18.6(1Y) U20.65(B:PE12)
IN4: C21.2 R4.1 R6.1 U$3.P33
IN4_IN: C22.1 R6.2 U12.1(1A)
IN4_MCU: U12.6(1Y) U20.67(B:PE14)
IN5: C17.2 R3.2 R5.1 U$3.P34
IN5_IN: C18.2 R5.2 U12.3(2A)
IN5_MCU: U12.4(2Y) U20.66(B:PE13)
IN6: C63.2 R26.2 R28.1 U$3.P51
IN6_IN: C64.2 R28.2 U31.3(2A)
IN6_MCU: U20.68(B:PE15) U31.4(2Y)
KNOCK1: C42.1 U$3.P12
KNOCK2: C67.1 U$3.P11
LED1: D8.A U20.2(B:PE3)
LED2: D1.A U20.3(B:PE4)
LED3: D7.A U20.4(B:PE5)
LED4: D14.A U20.5(B:PE6)
LS1: C48.2 D19.A U26.8(DRAIN1) U$3.P7
LS1_MCU_: RN5.8 RN6.5 U20.123(A:PD7)
LS2: C49.2 D18.A U26.6(DRAIN2) U$3.P6
LS2_MCU_: RN5.7 RN6.6 U20.124(B:PG9)
LS3: C11.1 D16.A U5.7(DRAIN1-1) U5.8(DRAIN1) U$3.P22
LS3_MCU_: RN5.6 RN6.7 U20.125(B:PG10)
LS4: C12.1 D17.A U5.5(DRAIN2-1) U5.6(DRAIN2) U$3.P23
LS4_MCU_: RN5.5 RN6.8 U20.126(B:PG11)
LS5: C10.1 D20.A U6.7(DRAIN1-1) U6.8(DRAIN1) U$3.P5
LS5_MCU_: RN1.8 RN2.5 U20.127(B:PG12)
LS6: C9.1 D21.A U6.5(DRAIN2-1) U6.6(DRAIN2) U$3.P24
LS6_MCU_: RN1.7 RN2.6 U20.128(B:PG13)
LS7: C2.1 U3.7(DRAIN1-1) U3.8(DRAIN1) U$3.P25
LS7_MCU_: RN1.6 RN2.7 U20.129(B:PG14)
LS8: C1.1 U3.5(DRAIN2-1) U3.6(DRAIN2) U$3.P4
LS8_MCU_: RN1.5 RN2.8 U20.134(A:PB4(NJTRST))
LS9: C3.1 U2.7(DRAIN1-1) U2.8(DRAIN1) U$3.P26
LS10: C8.1 U2.5(DRAIN2-1) U2.6(DRAIN2) U$3.P3
LS11: C15.1 U7.7(DRAIN1-1) U7.8(DRAIN1) U$3.P27
LS11_MCU_: RN3.8 RN4.5 U20.137(A:PB7)
LS12: C16.1 U7.5(DRAIN2-1) U7.6(DRAIN2) U$3.P28
LS12_MCU_: RN3.7 RN4.6 U20.139(A:PB8)
LS13: C14.1 U8.7(DRAIN1-1) U8.8(DRAIN1) U$3.P2
LS13_MCU_: RN3.6 RN4.7 U20.140(A:PB9)
LS14: C13.1 U8.5(DRAIN2-1) U8.6(DRAIN2) U$3.P1
LS14_MCU_: RN3.5 RN4.8 U20.141(B:PE0)
LS15_MCU: R84.2 R87.2 U20.142(B:PE1)
LS16_MCU: R85.2 R86.2 U20.1(B:PE2)
N$1: C88.2 D12.C L2.P$1 U23.8(SW)
N$2: RN1.3 U3.4(INPUT2)
N$3: RN3.3 U5.4(INPUT2)
N$4: R85.1 U26.1(IN1)
N$5: R68.1 U22.1(VOUTA) U22.2(VINA-)
N$6: R84.1 U26.3(IN2)
N$7: RN5.2 U8.2(INPUT1)
N$8: RN1.4 U3.2(INPUT1)
N$9: RN5.1 U8.4(INPUT2)
N$10: R8.1 U11.7(OUTA)
N$11: C55.1 R49.1 U19.9(IN2+)
N$12: C91.+ C92.1 L3.2 U23.2(VIN) U23.3(EN)
N$13: C81.1 U$1.1(VOUTA) U$1.3(VINA+)
N$14: C55.2 R48.1 U19.10(IN2-)
N$15: D6.C R23.1
N$16: C80.1 U$1.5(VINB+) U$1.7(VOUTB)
N$17: R40.2 U27.8(RS)
N$18: C71.1 D9.6 RN11.2 U22.5(VINB+)
N$19: C72.1 D9.4 RN11.1 U22.3(VINA+)
N$20: D8.C R24.1
N$21: C67.2 R61.1
N$22: R69.1 U22.6(VINB-) U22.7(VOUTB)
N$23: R70.1 U22.8(VOUTC) U22.9(VINC-)
N$24: R71.1 U22.13(VIND-) U22.14(VOUTD)
N$25: C42.2 R51.1
N$26: R51.2 R93.1 U25.2(VINA-)
N$27: R61.2 R94.1 U25.13(VIND-)
N$28: C70.1 D9.3 RN11.3 U22.10(VINC+)
N$29: C69.1 D9.1 RN11.4 U22.12(VIND+)
N$30: R46.1 R94.2 U25.14(VOUTD)
N$31: R33.1 R93.2 U25.1(VOUTA)
N$32: C73.1 R33.2 R62.1
N$33: C45.1 D2.3 RN13.3 U17.10(VINC+)
N$34: C44.1 D2.1 RN13.4 U17.12(VIND+)
N$35: R35.1 U17.1(VOUTA) U17.2(VINA-)
N$36: R9.1 U11.5(OUTB)
N$37: R36.1 U17.6(VINB-) U17.7(VOUTB)
N$38: R37.1 U17.8(VOUTC) U17.9(VINC-)
N$39: R38.1 U17.13(VIND-) U17.14(VOUTD)
N$40: C46.1 D2.6 RN13.2 U17.5(VINB+)
N$41: C47.1 D2.4 RN13.1 U17.3(VINA+)
N$42: C58.1 D5.3 RN14.3 U28.10(VINC+)
N$43: C57.1 D5.1 RN14.4 U28.12(VIND+)
N$45: R57.1 U28.1(VOUTA) U28.2(VINA-)
N$46: R58.1 U28.6(VINB-) U28.7(VOUTB)
N$47: R59.1 U28.8(VOUTC) U28.9(VINC-)
N$48: C60.1 D5.6 RN14.2 U28.5(VINB+)
N$49: C62.1 D5.4 RN14.1 U28.3(VINA+)
N$50: C74.2 R46.2 R63.1
N$51: C81.2 J5.2
N$52: C80.2 J5.3
N$53: C77.1 R62.2 R82.1
N$54: C78.2 R63.2 R83.1
N$55: D1.C R25.1
N$56: C75.1 R82.2 U25.5(VINB+)
N$57: D7.C R30.1
N$58: D14.C R31.1
N$59: C76.2 R83.2 U25.10(VINC+)
N$60: C104.2 U16.2(OUT) U20.32(C:VREF+)
N$61: R1023.1 U35.1(GATE)
N$62: R1022.1 U34.1(GATE)
N$63: R1021.2 U33.1(GATE)
N$64: C105.2 U20.71(B:VCAP_1)
N$65: C79.1 R64.1 R81.2 U25.3(VINA+) U25.12(VIND+)
N$66: C106.2 U20.106(B:VCAP_2)
N$67: C109.2 C110.2 FB1.1 U20.33(C:VDDA)
N$68: R1020.1 U32.1(GATE)
N$69: C107.1 U20.24(B:PH1-OSC_OUT(PH1)) Y1.1
N$70: C108.1 U20.23(B:PH0-OSC_IN(PH0)) Y1.2
N$71: R60.1 U28.13(VIND-) U28.14(VOUTD)
N$73: R97.2 SW2.2(S) SW2.4(S1) U20.138(B:BOOT0)
N$74: R101.1 U20.8(A:PC14-OSC32_IN(PC14))
N$75: R102.1 U20.9(A:PC15-OSC32_OUT(PC15))
N$92: RN1.1 U2.4(INPUT2)
N$93: RN1.2 U2.2(INPUT1)
N$94: R10.1 U13.7(OUTA)
N$95: R11.1 U13.5(OUTB)
N$101: R12.1 R1023.2 U14.7(OUTA)
N$103: R13.1 R1022.2 U14.5(OUTB)
N$104: R14.1 R1021.1 U15.7(OUTA)
N$105: R15.1 R1020.2 U15.5(OUTB)
N$110: RN3.2 U6.2(INPUT1)
N$111: RN3.1 U6.4(INPUT2)
N$119: RN3.4 U5.2(INPUT1)
N$145: C89.1 R90.1 R91.1 U23.5(FB)
N$148: D10.5(VBUS) D22.2(A) J6.1 J9.1
N$170: R66.2 U24.8(RS)
N$172: R88.2 U23.4(RT/SYNC)
N$180: C7.1 R77.1 U19.16(IN1+)
N$184: C87.1 U23.6(SS)
N$187: C88.1 U23.1(BOOT)
N$188: D13.C L3.1 R89.1
N$189: C7.2 R76.1 U19.15(IN1-)
N$202: C94.1 R89.2
N$213: RN5.3 U7.4(INPUT2)
N$214: RN5.4 U7.2(INPUT1)
OUT+: C39.2 U10.5(OUT1) U$3.P13
OUT-: C40.1 U10.7(OUT2) U$3.P14
RESET: C111.1 J3.10 R96.2 SW1.1(P) SW1.3(P1) U20.25(B:NRST)
SD_CS: J2.2(CD/DAT3) U20.116(A:PD2)
SD_MISO: J2.7(DAT0) U20.112(A:PC11)
SD_MOSI: J2.3(CMD) U20.113(A:PC12)
SD_SCK: J2.5(CLK) U20.111(A:PC10)
SHIELD: C114.1 J6.S1(SHIELD) J6.S2(SHIELD) J6.S3(SHIELD) J9.5 R100.2
SWCLK: J3.4 U20.109(A:PA14(JTCK-SWCLK))
SWDIO: J3.2 U20.105(A:PA13(JTMS-SWDIO))
UART_RX: J4.3 J7.2 U1.2(UART-RX) U20.122(A:PD6)
UART_TX: J4.4 J7.1 U1.1(UART-TX) U20.119(A:PD5)
Unconnected: D15.3 D15.4 D15.6 J2.1(DAT2) J2.8(DAT1) J3.6 J3.7 J3.8 J4.5 J4.6 J6.4 U1.3(!UART-CTS) U1.4(!UART-RTS) U1.5(PCM-CLK) U1.6(PCM-OUT) U1.7(PCM-IN) U1.8(PCN-SYNC) U1.9(AIO[0]) U1.10(AIO[1]) U1.11(!RESETB) U1.15(USB_-) U1.16(!SPI_CSB) U1.17(SPI_MOSI) U1.18(SPI_MISO) U1.19(SPI_CLK) U1.20(USB_+) U1.23(PIO[0]) U1.24(PIO[1]) U1.25(PIO[2]) U1.26(PIO[3]) U1.27(PIO[4]) U1.28(PIO[5]) U1.29(PIO[6]) U1.30(PIO[7]) U1.31(PIO[8]) U1.32(PIO[9]) U1.33(PIO[10]) U1.34(PIO[11]) U9.7(INT_DRDY) U10.3(SO) U10.8(SI) U10.9(CS_N) U10.10(SCK) U11.1(NC) U11.8(NC) U13.1(NC) U13.8(NC) U14.1(NC) U14.8(NC) U15.1(NC) U15.8(NC) U19.2(EXT1) U19.7(EXT2) U19.12(DIRN) U20.7(A:PC13) U20.10(B:PF0) U20.11(B:PF1) U20.12(B:PF2) U20.13(B:PF3) U20.22(B:PF10) U20.40(A:PA4) U20.41(A:PA5) U20.42(A:PA6) U20.49(B:PF11) U20.50(B:PF12) U20.53(B:PF13) U20.54(B:PF14) U20.55(B:PF15) U20.56(B:PG0) U20.57(B:PG1) U20.60(B:PE9) U20.63(B:PE10) U20.75(A:PB14) U20.76(A:PB15) U20.77(A:PD8) U20.78(A:PD9) U20.82(A:PD13) U20.85(A:PD14) U20.86(A:PD15) U20.87(B:PG2) U20.88(B:PG3) U20.89(B:PG4) U20.90(B:PG5) U20.100(A:PA8) U20.101(A:PA9) U20.102(A:PA10) U20.110(A:PA15(JTDI)) U20.132(B:PG15) U20.133(A:PB3(JTDO/TRACESWO)) U20.135(A:PB5) U20.136(A:PB6) U24.5(VR) U26.2(STATUS1) U26.4(STATUS2) U27.5(VR)

## Notes on the sheet
- EXTENCIONS
- POWER
- 5V SENSOR | KNOCK
- MICRO SD
- BARO SENSOR
- ETB
- CONNECTORS
- BLUETOOTH
- CANBUS
- BLUETOOTH
- ANALOG INPUT
- USB
- LS DRIVERS/GPO
- COIL DRIVERS | SEL_SWITCH
- MCU | HALL SENSORS
- CRANK SENSOR

## Library data of the parts
C1-C3 C8-C16 C25-C28 C31-C34 C39 C40 C48 C49 C54 C87 = SparkFun-Capacitors:10NF: 0.01uF/10nF/10,000pF ceramic capacitors A capacitor is a passive two-terminal electrical component used to store electrical energy temporarily in an electric field. CAP-09321; PROD_ID: CAP-00867
C4 C5 C82-C86 C97 C99 C104 C109 C111 = OPL_Capacitor:CERAMIC-10NF-50V-10%-X7R(0603): 302010140; MPN: CC0603KRX7R9BB103
C6 C53 C59 C92 C95 C96 = SparkFun-Capacitors:1.0UF: 1µF ceramic capacitors A capacitor is a passive two-terminal electrical component used to store electrical energy temporarily in an electric field.; PROD_ID: CAP-00868
C7 C17 C18 C21-C24 C50 C51 C55 C63-C66 = SparkFun-Capacitors:1.0NF/1000PF: 1nF/1,000pF ceramic capacitors A capacitor is a passive two-terminal electrical component used to store electrical energy temporarily in an electric field.; PROD_ID: CAP-07886
C19 C29 C30 C35-C37 C52 C61 C88 C114 C115 = SparkFun-Capacitors:0.1UF: 0.1µF ceramic capacitors A capacitor is a passive two-terminal electrical component used to store electrical energy temporarily in an electric field.; PROD_ID: CAP-00810; VALUE: 0.1uF
C20 = SparkFun-Capacitors:1.0UF: 1µF ceramic capacitors A capacitor is a passive two-terminal electrical component used to store electrical energy temporarily in an electric field.; PROD_ID: CAP-00868; VALUE: 1.0uF
C38 C94 = SparkFun-Capacitors:4.7UF: 4.7µF ceramic capacitors A capacitor is a passive two-terminal electrical component used to store electrical energy temporarily in an electric field.; PROD_ID: CAP-08280
C41 C91 = adafruit:CPOL-US: POLARIZED CAPACITOR, American symbol
C42 C67 = OPL_Capacitor:CERAMIC-10NF-50V-5%-X7R(0805): 302010175; MPN: CC0805JRX7R9BB103; VALUE: 10nf
C43 C56 C68 = SparkFun-Capacitors:33NF: 33nF ceramic capacitors A capacitor is a passive two-terminal electrical component used to store electrical energy temporarily in an electric field.; PROD_ID: CAP-07887
C44-C47 C57 C58 C60 C62 C69-C72 C98 = SparkFun-Capacitors:22PF: 22pF ceramic capacitors A capacitor is a passive two-terminal electrical component used to store electrical energy temporarily in an electric field.; PROD_ID: CAP-07876; VALUE: 22pF
C73 C74 = OPL_Capacitor:CERAMIC-100NF-50V-10%-X7R(0603): 302010138; MPN: CC0603KRX7R9BB104; VALUE: 100nf
C75 C76 = OPL_Capacitor:CERAMIC-47PF-50V-5%-NP0(0402): 302010007; MPN: CC0402JRNPO9BN470
C77 C78 = OPL_Capacitor:CERAMIC-390PF-50V-10%-X7R(0402): 302010260; MPN: CC0402KRX7R9BB391; VALUE: 390PF 50V
C79 = OPL_Capacitor:CERAMIC-10NF-50V-10%-X7R(0402): 302010006; MPN: CC0402KRX7R9BB103
C80 C81 = OPL_Capacitor:CERAMIC-10UF-10V-(-20%～+80%)-Y5V(0805): 302010158; MPN: CC0805ZKY5V6BB106
C89 = SparkFun-Capacitors:270PF: 270pF/0.27nF ceramic capacitors A capacitor is a passive two-terminal electrical component used to store electrical energy temporarily in an electric field.; PROD_ID: CAP-13339
C90 C93 = Seeed-Capacitor:CERAMIC-10UF-25V-10%-X5R(1206): 302010181; MPN: CC1206KKX5R8BB106
C100-C103 = OPL_Capacitor:CERAMIC-4.7UF-10V-10%-X5R(0603): 302010111; MPN: CC0603KRX5R6BB475
C105 C106 = OPL_Capacitor:CERAMIC-2.2UF-10V-10%-X7R(0603): 302010054; MPN: CC0603KRX7R6BB225
C107 C108 = OPL_Capacitor:CERAMIC-33PF-50V-5%-NPO(0402): 302010000; MPN: CC0402JRNPO9BN330
C110 = OPL_Capacitor:CERAMIC-4.7NF-50V-10%-X7R(0603): 302010144; MPN: CC0603KRX7R9BB472; VALUE: 4.7nf
C112 C116 = OPL_Capacitor:CERAMIC-1UF-25V-10%-X7R(0603): 302010139; MPN: CC0603KRX7R8BB105
C113 = OPL_Capacitor:CERAMIC-10UF-25V-10%-X5R(1206): 302010181; MPN: CC1206KKX5R8BB106
D1 = SparkFun-LED:LED-BLUE: Blue SMD LED Used in manufacturing of various products at SparkFun Packages: 0603 - SMD 0603 package [Product Link] <http://www.digikey.com/product-detail/en/SMLE12BC7TT86/511-1589-2-ND/1641808> 1206 - SMD1206 package [Product Link] <http://www.digikey.com/product-detail/en/lite-on-inc/LTST-C150TBKT/160-1643-1-ND/573584> SparkFun Products: ESP8266 Thing-Dev Board <https://www.sparkfun.com/products/13711> RedBoard <https://www.sparkfun.com/products/12757>; PROD_ID: DIO-08575
D2 D5 D9 D15 = SRV05-4.TCT:SRV05-4.TCT: Semtech SRV05-4.TCT, Uni-Directional TVS Diode Array, 300W, 6-Pin SOT-23 Source: Datasheet <https://componentsearchengine.com/Datasheets/1/SRV05-4.TCT.pdf> Check prices <https://pricing.snapeda.com/search/part/SRV05-4.TCT/?ref=eda>; AVAILABILITY: Good; DESCRIPTION: 17.5V Clamp 12A (8/20µs) Ipp Tvs Diode Surface Mount SOT-23-6; MF: Semtech; MP: SRV05-4.TCT; PACKAGE: SOT-23 Semtech; PRICE: None; PURCHASE-URL: https://pricing.snapeda.com/search/part/SRV05-4.TCT/?ref=eda
D3 = SMCJ45CA:SMCJ45CA: 38.9V Clamp 38.6A Ipp Tvs Diode Surface Mount DO-214AB (SMCJ) Check prices <https://pricing.snapeda.com/search/part/SMCJ45CA/?ref=eda>; AVAILABILITY: Good; DESCRIPTION: 1500 W Bi-Directional 72.7 V SMT Transient Voltage Suppressor Diode - DO-214AB; MF: ON Semiconductor; MP: SMCJ45CA; PACKAGE: DO-214AB-214 ON Semiconductor; PRICE: None; PURCHASE-URL: https://pricing.snapeda.com/search/part/SMCJ45CA/?ref=eda
D4 D11 = diode:PESD1CAN: CAN bus ESD protection diode Source: http://www.nxp.com/documents/data_sheet/PESD1CAN.pdf
D6 D7 = SparkFun-LED:LED-GREEN: Green SMD LED Used in manufacturing of various products at SparkFun Packages: 0603 - SMD 0603 package [Product Link] <http://www.futureelectronics.com/en/technologies/semiconductors/optoelectronics/leds/Pages/9894312-LTST-C190GKT.aspx?CrossPart=HSMG-C190&IM=0> LilyPad 1206 - SMD1206 LilyPad package [Product Link] <http://www.futureelectronics.com/en/Technologies/Product.aspx?ProductID=IN150NGHARVATEKCORPORATION2049943&IM=0> 1206 - SMD1206 package [Product Link] <http://www.futureelectronics.com/en/technologies/semiconductors/optoelectronics/leds/Pages/8315665-LTST-C150KGKT.aspx?IM=0> 1206 Bottom Mount -SMD 1206 Bottom Mount [Product Link] <http://www.digikey.com/product-detail/en/lite-on-inc/LTST-C230KGKT/160-1456-1-ND/386854> SparkFun Products: Pro Mini 328 -5V <https://www.sparkfun.com/products/821> RedBoard <https://www.sparkfun.com/products/12757> MP3 Trigger <https://www.sparkfun.com/products/13720> Makey Makey <https://www.sparkfun.com/products/11076>; PROD_ID: DIO-00821
D8 = SparkFun-LED:LED-RED: Red SMD LED Used in manufacturing of most products at SparkFun Packages: 0603 - SMD 0603 package [Product Link] <http://docs.avagotech.com/docs/AV02-0551EN> 0603 SMART - SMD 0603 SMART package ( more efficient and expensive)[Product Link] <http://www.osram-os.com/Graphics/XPic2/00077099_0.pdf> 1206 - SMD1206 package [Product Link] <https://www.sparkfun.com/datasheets/DevTools/LilyPad/Q150OVS4.pdff> SparkFun Products: Pro Mini 328 -5V <https://www.sparkfun.com/products/821> RedBoard <https://www.sparkfun.com/products/12757> IOIO-OTG <https://www.sparkfun.com/products/13613>; PROD_ID: DIO-00819
D10 = USBLC6-2SC6:USBLC6-2SC6: 17V Clamp 5A (8/20µs) Ipp Tvs Diode Surface Mount SOT-23-6 Check prices <https://pricing.snapeda.com/parts/USBLC6-2SC6/STMicroelectronics/view-part?ref=eda>; AVAILABILITY: Good; DESCRIPTION: 17V Clamp 5A (8/20µs) Ipp Tvs Diode Surface Mount SOT-23-6; MF: STMicroelectronics; MP: USBLC6-2SC6; PACKAGE: SOT-23-6 STMicroelectronics; PRICE: None; PURCHASE-URL: https://pricing.snapeda.com/search/part/USBLC6-2SC6/?ref=eda
D12 D13 = SparkFun-DiscreteSemi:DIODE-SCHOTTKY: Schottky diode A Schottky diode is a semiconductor diode which has a low forward voltage drop and a very fast switching action.; PROD_ID: DIO-09886; VALUE: 3A/40V/500mV
D14 = SparkFun-LED:LED-YELLOW: Yellow SMD LED Used in manufacturing several products at SparkFun. Packages: 0603 - SMD 0603 package[Product Link] <http://www.kingbrightusa.com/product.asp?catalog_name=LED&product_id=APT1608SYCK> 0603 -SMART - SMART SMD 0603 package (more efficient/more expensive) [Product Link] <http://www.osram-os.com/osram_os/en/products/product-catalog/led-light-emitting-diodes/smartled-0603/ly-l29k/index.jsp> LilyPad - SMD1206 package[Product Datasheet] <https://www.sparkfun.com/datasheets/DevTools/LilyPad/Q150YUS4.pdf> SparkFun Products: Blynk Board <https://www.sparkfun.com/products/13794> IOIO-OTG <https://www.sparkfun.com/products/13613> XBee Explorer Serial <https://www.sparkfun.com/products/13225>; PROD_ID: DIO-09003
D16-D21 = adafruit:DIODE: Diode SMADIODE - SMA Surface Mount Package 20V 1A Schottky Diode Digikey: 641-1014-6-ND DO-1N4148 - Through Hole Small Current Diode SOD-123 20V 1 A (.5mV Vf) Schottky Diode - Digikey: MBRX120TPMSCT-ND SOD-323 10V 570mA (.38mV Vf, 3ns) Schottky Diode - Digikey: ZLLS410CT-ND SOD-523 30V 30mA Schottky Diode (RB751S-40TE61) - Digikey: RB751S-40TE61CT-ND SOT23-R/W - SOT23 Package (R = Solder Paste/Reflow Ovens, W = Hand-Soldering) BAT54Film 40V 300mA - Digikey: 497-7162-1-ND
D22 = Diode:SCHOTTKY_: Schottky Diode - Popular parts; CATEGORY: Diode; DESCRIPTION: DIODE SCHOTTKY 20V 500MA SOD123; MANUFACTURER: ON Semiconductor; MPN: MBR0520LT1G; SUB-CATEGORY: Schottky
FB1 = Filter:FB: Ferrite Bead - Generic; CATEGORY: Filter; SUB-CATEGORY: Ferrite bead
J2 = 47219-2001:47219-2001: 1.10mm Pitch microSD Card Connector, Hinge Type, Lead-Free http://www.snapeda.com/parts/47219-2001/Molex%20/%20Waldom/view-part/# Check prices <https://pricing.snapeda.com/parts/47219-2001/Molex/view-part?ref=eda>; AVAILABILITY: Warning; DESCRIPTION: 8 Position Card Connector Secure Digital - microSD™ Surface Mount, Right Angle Gold; MF: Molex; MP: 47219-2001; PACKAGE: None; PRICE: None; PURCHASE-URL: https://pricing.snapeda.com/search/part/47219-2001/?ref=eda
J3 = Headers:62131021021: 1.27mm SMT Straight Dual Pin Header WR-PHD 10POS Manufacturer's datasheet <https://katalog.we-online.com/em/datasheet/62131021021.pdf>; CREATED_BY: PCBLayout.com; MANUFACTURER: WURTH ELEKTRONIK; MPN: 62131021021
J4 = SparkFun-Connectors2:CONN_06: Multi connection point. Often used as Generic Header-pin footprint for 0.1 inch spaced/style header connections On any of the 0.1 inch spaced packages, you can populate with these: Break Away Headers - Straight <https://www.sparkfun.com/products/116> (PRT-00116) Break Away Male Headers - Right Angle <https://www.sparkfun.com/products/553> (PRT-00553) Female Headers <https://www.sparkfun.com/products/115> (PRT-00115) Break Away Headers - Machine Pin <https://www.sparkfun.com/products/117> (PRT-00117) Break Away Female Headers - Swiss Machine Pin <https://www.sparkfun.com/products/743> (PRT-00743) Arduino Stackable Header - 6 Pin <https://www.sparkfun.com/products/9280> (PRT-09280) For SCREWTERMINALS and SPRING TERMINALS visit here: Screw Terimnals on SparkFun.com <https://www.sparkfun.com/search/results?term=Screw+Terminals> (5mm/3.5mm/2.54mm spacing) This device is also useful as a general connection point to wire up your design to another part of your project. Our various solder wires solder well into these plated through hole pads. Hook-Up Wire - Assortment (Stranded, 22 AWG) <https://www.sparkfun.com/products/11375> (PRT-11375) Hook-Up Wire - Assortment (Solid Core, 22 AWG) <https://www.sparkfun.com/products/11367> (PRT-11367) View the entire wire category on our website here <https://www.sparkfun.com/categories/141>
J5 = SJ1-3533NG:SJ1-3533NG: 3.5 mm Right-Angle Stereo Jack, 3 Pin PCB Mount, Isolated Ground Check prices <https://pricing.snapeda.com/parts/SJ1-3533NG/CUI%20Devices/view-part?ref=eda>; AVAILABILITY: Good; CUI_PURCHASE_URL: https://www.cuidevices.com/product/interconnect/connectors/audio-connectors/jacks/sj1-353xng-series?utm_source=snapeda.com&utm_medium=referral&utm_campaign=snapedaBOM; DESCRIPTION: 3.5 mm, Stereo, Right Angle, Through Hole, Isolated Ground, Audio Jack Connector; MF: CUI Devices; MP: SJ1-3533NG; PACKAGE: None; PRICE: None; PURCHASE-URL: https://pricing.snapeda.com/search/part/SJ1-3533NG/?ref=eda
J6 = 1734753-1:1734753-1: Conn Mini USB 2.0 Type B RCP 5 POS 0.8mm Solder ST Thru-Hole 5 Terminal 1 Port Tray Check prices <https://pricing.snapeda.com/parts/1734753-1/TE%20Connectivity/view-part?ref=eda>; AVAILABILITY: Good; CENTERLINE_PITCH: .8 mm[.031 in]; COMMENT: 1734753-1; DESCRIPTION: Conn Mini USB 2.0 Type B RCP 5 POS 0.8mm Solder ST Thru-Hole 5 Terminal 1 Port Box/Tray; EU_ROHS_COMPLIANCE: Compliant; MF: TE Connectivity; MP: 1734753-1; NUMBER_OF_POSITIONS: 5; PACKAGE: None; PRICE: None; PRODUCT_TYPE: Connector; PURCHASE-URL: https://pricing.snapeda.com/search/part/1734753-1/?ref=eda
J7 = SparkFun-Connectors:CONN_02: Multi connection point. Often used as Generic Header-pin footprint for 0.1 inch spaced/style header connections On any of the 0.1 inch spaced packages, you can populate with these: Break Away Headers - Straight <https://www.sparkfun.com/products/116> (PRT-00116) Break Away Male Headers - Right Angle <https://www.sparkfun.com/products/553> (PRT-00553) Female Headers <https://www.sparkfun.com/products/115> (PRT-00115) Break Away Headers - Machine Pin <https://www.sparkfun.com/products/117> (PRT-00117) Break Away Female Headers - Swiss Machine Pin <https://www.sparkfun.com/products/743> (PRT-00743) For SCREWTERMINALS and SPRING TERMINALS visit here: Screw Terimnals on SparkFun.com <https://www.sparkfun.com/search/results?term=Screw+Terminals> (5mm/3.5mm/2.54mm spacing) This device is also useful as a general connection point to wire up your design to another part of your project. Our various solder wires solder well into these plated through hole pads. Hook-Up Wire - Assortment (Stranded, 22 AWG) <https://www.sparkfun.com/products/11375> (PRT-11375) Hook-Up Wire - Assortment (Solid Core, 22 AWG) <https://www.sparkfun.com/products/11367> (PRT-11367) View the entire wire category on our website here <https://www.sparkfun.com/categories/141> Special notes: Molex polarized connector foot print use with: PRT-08233 with associated crimp pins and housings. 2.54_SCREWTERM for use with PRT-10571. 3.5mm Screw Terminal footprints for PRT-08084 5mm Screw Terminal footprints for use with PRT-08432
J8 = SparkFun-Connectors:CONN_06: Multi connection point. Often used as Generic Header-pin footprint for 0.1 inch spaced/style header connections On any of the 0.1 inch spaced packages, you can populate with these: Break Away Headers - Straight <https://www.sparkfun.com/products/116> (PRT-00116) Break Away Male Headers - Right Angle <https://www.sparkfun.com/products/553> (PRT-00553) Female Headers <https://www.sparkfun.com/products/115> (PRT-00115) Break Away Headers - Machine Pin <https://www.sparkfun.com/products/117> (PRT-00117) Break Away Female Headers - Swiss Machine Pin <https://www.sparkfun.com/products/743> (PRT-00743) Arduino Stackable Header - 6 Pin <https://www.sparkfun.com/products/9280> (PRT-09280) For SCREWTERMINALS and SPRING TERMINALS visit here: Screw Terimnals on SparkFun.com <https://www.sparkfun.com/search/results?term=Screw+Terminals> (5mm/3.5mm/2.54mm spacing) This device is also useful as a general connection point to wire up your design to another part of your project. Our various solder wires solder well into these plated through hole pads. Hook-Up Wire - Assortment (Stranded, 22 AWG) <https://www.sparkfun.com/products/11375> (PRT-11375) Hook-Up Wire - Assortment (Solid Core, 22 AWG) <https://www.sparkfun.com/products/11367> (PRT-11367) View the entire wire category on our website here <https://www.sparkfun.com/categories/141>; PROD_ID: CONN-08437
J9 = SparkFun-Connectors_2:CONN_05: Multi connection point. Often used as Generic Header-pin footprint for 0.1 inch spaced/style header connections On any of the 0.1 inch spaced packages, you can populate with these: Break Away Headers - Straight <https://www.sparkfun.com/products/116> (PRT-00116) Break Away Male Headers - Right Angle <https://www.sparkfun.com/products/553> (PRT-00553) Female Headers <https://www.sparkfun.com/products/115> (PRT-00115) Break Away Headers - Machine Pin <https://www.sparkfun.com/products/117> (PRT-00117) Break Away Female Headers - Swiss Machine Pin <https://www.sparkfun.com/products/743> (PRT-00743) For SCREWTERMINALS and SPRING TERMINALS visit here: Screw Terimnals on SparkFun.com <https://www.sparkfun.com/search/results?term=Screw+Terminals> (5mm/3.5mm/2.54mm spacing) This device is also useful as a general connection point to wire up your design to another part of your project. Our various solder wires solder well into these plated through hole pads. Hook-Up Wire - Assortment (Stranded, 22 AWG) <https://www.sparkfun.com/products/11375> (PRT-11375) Hook-Up Wire - Assortment (Solid Core, 22 AWG) <https://www.sparkfun.com/products/11367> (PRT-11367) View the entire wire category on our website here <https://www.sparkfun.com/categories/141> Special notes: Molex polarized connector foot print use with SKU : PRT-08231 with associated crimp pins and housings. 1MM SMD Version SKU: PRT-10208
L2 = INDUCTOR_HZ:L-US: INDUCTOR, American symbol
L3 = rcl:L-US: INDUCTOR, American symbol; SPICEPREFIX: L
R1 R48-R50 R76 R77 = OPL_Resistor:SMD-RES-10K-1%-1/8W(0805): 301012152; MPN: RC0805FR-0710KL
R2-R4 R26 R27 R44 = Seeed-Resistor:SMD-RES-2.2K-5%-1/10W(0603): 301010124; MPN: RC0603JR-072K2L
R5-R7 R28 R29 R45 = Seeed-Resistor:SMD-RES-3.3K-1%-1/10W(0603): 301010251; MPN: RC0603FR-073K3L
R8-R15 = OPL_Resistor:SMD-RES-100R-5%-1/8W(0805): 301010319; MPN: RC0805JR-07100RL
R16 R17 R34 R80 = Seeed-Resistor:SMD-RES-2K-1%-1/10W(0603): 301010221; MPN: RC0603FR-072KL; VALUE: 2K
R18-R22 R40 R53-R56 R65-R67 R78 R79 R88 R101 R102 = Seeed-Resistor:SMD-RES-10K-1%-1/10W(0603): 301010299; MPN: RC0603FR-0710KL
R23-R25 R30 R31 = OPL_Resistor:SMD-RES-330R-1%-1/16W(0402): 301011998; MPN: RC0402FR-07330RL
R32 R95 = OPL_Resistor:SMD-RES-2.2K-1%-1/10W(0603): 301012059; MPN: RC0603FR-071K5L; VALUE: 1.5K
R33 R46 R90 = OPL_Resistor:SMD-RES-12K-1%-1/16W(0402): 301011982; MPN: RC0402JR-070RL; VALUE: 0R
R35-R38 R57-R60 R68-R71 = Seeed-Resistor:SMD-RES-330R-1%-1/10W(0603): 301010300; MPN: RC0603FR-07330RL; VALUE: 330R
R39 R42 R43 R52 R72-R75 = OPL_Resistor:SMD-RES-470K-1%-1/10W(0603): 301012073; MPN: RC0603FR-071K5L; VALUE: 1.5K
R41 R92 = Seeed-Resistor:SMD-RES-100R-5%-1/10W(0603): 301010090; MPN: RC0603JR-07100RL; VALUE: 100R
R47 = varistor:VARISTOR: VARISTOR
R51 R61-R63 R100 = OPL_Resistor:SMD-RES-100K-1%-1/16W(0402): 301010456; MPN: RC0402FR-07100KL
R64 R81 = OPL_Resistor:SMD-RES-22R-1%-1/16W(0402): 301010052; MPN: RC0402FR-0722RL; VALUE: 22R
R82 R83 = OPL_Resistor:SMD-RES-30K-1%-1/16W(0402): 301011997; MPN: RC0402JR-070RL; VALUE: 0R
R84-R87 = OPL_Resistor:SMD-RES-1K-1%-1/16W(0402): 301011989; MPN: RC0402JR-070RL; VALUE: 0R
R89 = Seeed-Resistor:SMD-RES-0R-5%-1/10W(0603): 301010292; MPN: RC0603JR-070RL; VALUE: 0R
R91 = Seeed-Resistor:SMD-RES-68K-1%-1/10W(0603): 301010169; MPN: RC0603FR-0768KL
R93 R94 = OPL_Resistor:SMD-RES-470K-1%-1/16W(0402): 301010069; MPN: RC0402FR-07470KL
R96-R98 = OPL_Resistor:SMD-RES-10K-1%-1/10W(0603): 301011970; MPN: RC0603FR-0710KL
R99 = OPL_Resistor:SMD-RES-120K-1%-1/10W(0603): 301012032; MPN: RC0603FR-071K5L; VALUE: 1.5K
R1020-R1023 = OPL_Resistor:SMD-RES-330R-1%-1/8W(0805): 301012167; MPN: RC0805JR-071KL; VALUE: 1K
RN1-RN8 RN11 RN13 RN14 = resistor-dil:4R-N: Array Chip Resistor Source: RS Component / Phycomp; OC_FARNELL: unknown; OC_NEWARK: unknown
S1 S3 = JS202011SCQN:JS202011SCQN: JS Series DPDT On-On Gull Wing Surface Mount Subminiature Slide Switch Check prices <https://pricing.snapeda.com/search/part/JS202011SCQN/?ref=eda>; AVAILABILITY: Good; DESCRIPTION: Slide Switch DPDT Surface Mount; MF: C&K; MP: JS202011SCQN; PACKAGE: None; PRICE: None; PURCHASE-URL: https://pricing.snapeda.com/search/part/JS202011SCQN/?ref=eda
SW1 SW2 = adafruit:SPST_TACT: SMT 6mm switch, EVQQ2 series http://www.ladyada.net/library/eagle
TP1-TP3 = SparkFun-Connectors:TEST-POINT: SparkFun Test Points Bare copper test points for troubleshooting or In-Circuit-Testing. These are used by our Production team for verifying production board runs using pogo-pins on test beds. SparkFun Products: SparkFun LSM9DS1 Breakout <https://www.sparkfun.com/products/13284> SparkFun PSOC <https://www.sparkfun.com/products/13714> SparkFun Load Cell Amplifier <https://www.sparkfun.com/products/13879>
U1 = HC-05:HC-05: Bluetooth to Serial Port Module; AVAILABILITY: Unavailable; DESCRIPTION: Bluetooth to Serial Port Module; MF: Bel Power solution; MP: HC-05; PACKAGE: SOIC-14; PRICE: None
U2 U3 U5-U8 = VNS3NV04DP-E:VNS3NV04DP-E: None; MANUFACTURER: STMicroelectronics; PACKAGE: SOIC127P600X175-8N
U9 = LPS25HBTR:LPS25HBTR: LPS25H Series 1260 hpa Absolute Digital Out Barometer Pressure Sensor HCLGA-10 Check prices <https://pricing.snapeda.com/parts/LPS25HBTR/STMicroelectronics/view-part?ref=eda>; AVAILABILITY: Good; DESCRIPTION: Pressure Sensor 3.77PSI ~ 18.27PSI (26kPa ~ 126kPa) Absolute 24 b 10-VFLGA; MF: STMicroelectronics; MP: LPS25HBTR; PACKAGE: VFLGA-10 STMicroelectronics; PRICE: None; PURCHASE-URL: https://pricing.snapeda.com/search/part/LPS25HBTR/?ref=eda
U10 = TLE9201SG:TLE9201SG: TLE9201SG 6 A H-Bridge with SPI SOP100P1030X260-13N Check prices <https://pricing.snapeda.com/parts/TLE9201SG/Infineon%20Technologies/view-part?ref=eda>; AVAILABILITY: Warning; DESCRIPTION: Half Bridge (2) Driver DC Motors, General Purpose Power MOSFET PG-DSO-12-17; MF: Infineon Technologies; MP: TLE9201SG; PACKAGE: BSOP-12 Infineon Technologies; PRICE: None; PURCHASE-URL: https://pricing.snapeda.com/search/part/TLE9201SG/?ref=eda
U11 U13-U15 = MIC4427YMM-TR:MIC4427YMM-TR: None Check prices <https://pricing.snapeda.com/search/part/MIC4427YMM-TR/?ref=eda>; AVAILABILITY: Warning; DESCRIPTION: Low-Side Gate Driver IC Non-Inverting 8-MSOP; MF: Microchip; MP: MIC4427YMM-TR; PACKAGE: MSOP-8 Microchip; PRICE: None; PURCHASE-URL: https://pricing.snapeda.com/search/part/MIC4427YMM-TR/?ref=eda
U12 U18 U31 = 74HC2G17GW_125:74HC2G17GW,125: None Check prices <https://pricing.snapeda.com/search/part/74HC2G17GW%2C125/?ref=eda>; AVAILABILITY: Good; DESCRIPTION: Buffer, Non-Inverting 2 Element 1 Bit per Element Push-Pull Output 6-TSSOP; MF: Nexperia USA; MP: 74HC2G17GW,125; PACKAGE: TSSOP6-6 Nexperia USA Inc.; PRICE: None; PURCHASE-URL: https://pricing.snapeda.com/search/part/74HC2G17GW,125/?ref=eda
U16 = REF3033AIDBZR:REF3033AIDBZR: CMOS VOLTAGE REFERENCE Check prices <https://pricing.snapeda.com/parts/REF3033AIDBZR/Texas%20Instruments/view-part?ref=eda>; AVAILABILITY: Good; DESCRIPTION: 3.3-V, 50-ppm/C, 50-A in 3-pin SOT-23 package series (bandgap) voltage reference 3-SOT-23 -40 to 125; MF: Texas Instruments; MP: REF3033AIDBZR; PACKAGE: SOT-23-3 Texas Instruments; PRICE: None; PURCHASE-URL: https://pricing.snapeda.com/search/part/REF3033AIDBZR/?ref=eda
U17 U22 U25 U28 = MCP6004-E_SL:MCP6004-E/SL: Check prices <https://pricing.snapeda.com/parts/MCP6004-E/SL/Microchip%20Technology/view-part?ref=eda>; AVAILABILITY: Good; DESCRIPTION: General Purpose Amplifier 4 Circuit Rail-to-Rail 14-SOIC; MF: Microchip Technology; MP: MCP6004-E/SL; PACKAGE: SOIC-14 Microchip; PRICE: None; PURCHASE-URL: https://pricing.snapeda.com/search/part/MCP6004-E/SL/?ref=eda
U19 = MAX9926UAEE_:MAX9926UAEE+: None Check prices <https://pricing.snapeda.com/search/part/MAX9926UAEE%2B/?ref=eda>; AVAILABILITY: Warning; DESCRIPTION: IC SENSOR INTERFACE VARI 16-QSOP; MF: Maxim Integrated; MP: MAX9926UAEE+; PACKAGE: QSOP-16 Maxim; PRICE: None; PURCHASE-URL: https://pricing.snapeda.com/search/part/MAX9926UAEE+/?ref=eda
U20 = STMicroelectronics - STM32F429ZGT6:STMICROELECTRONICS_STM32F429ZGT6: MC-ARM-STM32F4X9-SQ144; CIIVA_IDS: 8953766; COMPONENT_LINK_1_DESCRIPTION: Manufacturer URL; COMPONENT_LINK_1_URL: http://www.st.com/web/en/home.html; COMPONENT_LINK_3_DESCRIPTION: Package Specification; COMPONENT_LINK_3_URL: http://www.st.com/st-web-ui/static/active/en/resource/technical/document/datasheet/DM00037051.pdf; CORE: ARM Cortex-M4; DATASHEET: http://www.st.com/st-web-ui/static/active/en/resource/technical/document/data_brief/DM00053488.pdf; DATASHEET_VERSION: Rev. 2; DA_CONVERTER: 2x12-bit; FLASH_SIZE_PROG_KB: 1024; FOOTPRINT_VARIANT_NAME_0: STM-LQFP144_V; FOOTPRINT_VARIANT_NAME_1: Level C; FOOTPRINT_VARIANT_NAME_2: Level B; FOOTPRINT_VARIANT_NAME_3: Level A; IMPORTED: yes; IMPORTED_FROM: vault; IMPORT_TS: 1521864951; INTERNAL_RAM_SIZE_KB: 256; IOS_HIGH_CURRENT: 114; MF: STMicroelectronics; MOUNTING_TECHNOLOGY: Surface Mount; MPN: STM32F429ZGT6; OPERATING_FREQUENCYF_PROCESSOR_SPEED_MHZ: 180; PACKAGE: LQFP144; PACKAGE_DESCRIPTION: 144-Pin Low Profile Quad Flat Package, 20 x 20 mm Body, 0.5 mm Pitch; PACKAGE_VERSION: Rev. 4, 06/2013; PACKING: Tray; PREFIX: U; RELEASE_DATE: 1387178199; SUPPLY_VOLTAGEVCC_MAX_V: 3.6; SUPPLY_VOLTAGEVCC_MIN_V: 1.8; VAULT_GUID: FBE23569-F377-4554-AA9E-D10E5A76CA7B; VAULT_REVISION: AA4ADCA5-2C94-40B1-8FBA-E91B2EF3A22E
U21 = TLE4251DATMA1:TLE4251DATMA1: None Check prices <https://pricing.snapeda.com/parts/TLE4251DATMA1/Infineon%20Technologies/view-part?ref=eda>; AVAILABILITY: Warning; DESCRIPTION: Output tracking tolerance ? 0.2% | 400 mA output current capability | Enable Function | Very low current consumption in OFF mode | Wide operation range: up to 40 V | Wide temperature range: -40 C ? T j ? 150 C | Output protected against short circuit | Overtemperature protection | Reverse polarity proof | Green Product (RoHS compliant) | AEC Qualified; MF: Infineon Technologies; MP: TLE4251DATMA1; PACKAGE: TO-252-5 Infineon Technologies; PRICE: None; PURCHASE-URL: https://pricing.snapeda.com/search/part/TLE4251DATMA1/?ref=eda
U23 = LMR14020SDDAR:LMR14020SDDAR: Check prices <https://pricing.snapeda.com/search/part/LMR14020SDDAR/?ref=eda>; AVAILABILITY: Warning; DESCRIPTION: SIMPLE SWITCHER, 4-V to 40-V, 2-A 2.2-MHz step-down converter with Low IQ 8-SO PowerPAD -40 to 125; MF: Texas Instruments; MP: LMR14020SDDAR; PACKAGE: HSOIC-8 Texas Instruments; PRICE: None; PURCHASE-URL: https://pricing.snapeda.com/search/part/LMR14020SDDAR/?ref=eda
U24 U27 = smd-footprints:SN65HVD230
U26 = VNLD5090TR-E:VNLD5090TR-E: None Check prices <https://pricing.snapeda.com/parts/VNLD5090TR-E/STMicroelectronics/view-part?ref=eda>; AVAILABILITY: Warning; DESCRIPTION: Power Switch/Driver 1:1 N-Channel 13A 8-SO; MF: STMicroelectronics; MP: VNLD5090TR-E; PACKAGE: SOIC-8 STMicroelectronics; PRICE: None; PURCHASE-URL: https://pricing.snapeda.com/search/part/VNLD5090TR-E/?ref=eda
U29 = AMS1117-3.3:AMS1117-3.3: Sot223/Pkg 1-Amp 3.3-Volt Low Drop Out Voltage Regulatator; AVAILABILITY: Unavailable; DESCRIPTION: Sot223/Pkg 1-Amp 3.3-Volt Low Drop Out Voltage Regulatator; MF: Advanced Monolithic Systems; MP: AMS1117-3.3; PACKAGE: SOT-89 ams; PRICE: None
U32-U35 = ISL9V3040D3STV:ISL9V3040D3STV: None Check prices <https://pricing.snapeda.com/parts/ISL9V3040D3STV/ON%20Semiconductor/view-part?ref=eda>; AVAILABILITY: Bad; DESCRIPTION: N-Channel Ignition IGBT Chip; MF: ON Semiconductor; MP: ISL9V3040D3STV; PACKAGE: DPAK-3 ON Semiconductor; PRICE: None
U$1 = MCP6002-E_SN:MCP6002-E/SN: Check prices <https://pricing.snapeda.com/parts/MCP6002-E/SN/Microchip/view-part?ref=eda>; AVAILABILITY: Good; DESCRIPTION: General Purpose Amplifier 2 Circuit Rail-to-Rail 8-SOIC; MF: Microchip; MP: MCP6002-E/SN; PACKAGE: SOIC-8 Microchip; PRICE: None; PURCHASE-URL: https://pricing.snapeda.com/search/part/MCP6002-E/SN/?ref=eda
U$3 = 776087-2:211PL562L0011
Y1 = 52101-101-REV-A_v16:CRYSTAL_NX5032GA: CRYSTAL